# EAGLE design P2P_PROT_1 (EAGLE 6.5.0)

## Sheet 1 of 9
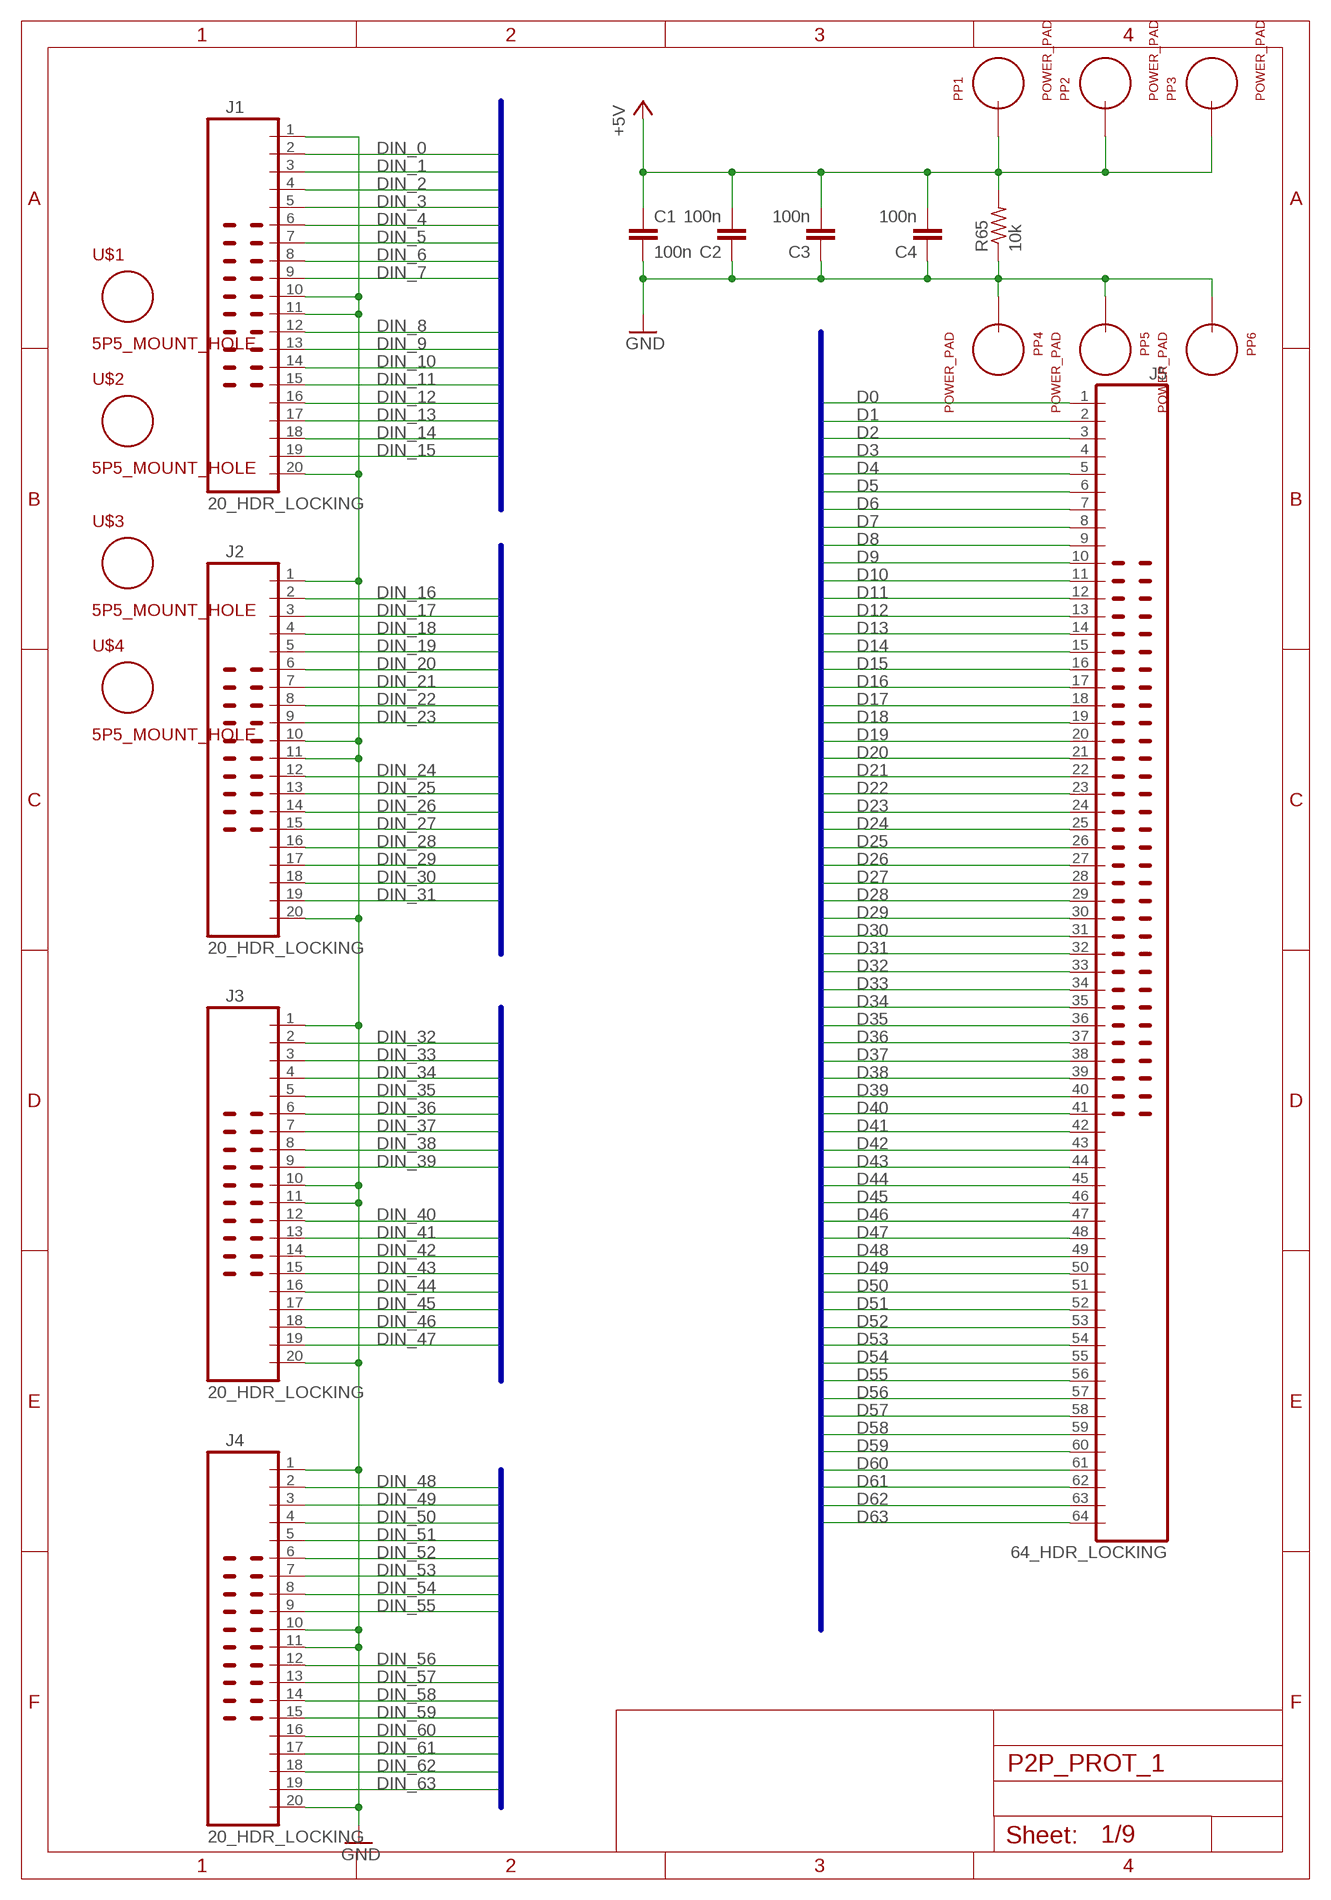
[diagram p0: schematic, sheet 1]

### Parts
C1  100n  C_P2INCH  [CAP_P2INCH]
C2  100n  C_P2INCH  [CAP_P2INCH]
C3  100n  C_P2INCH  [CAP_P2INCH]
C4  100n  C_P2INCH  [CAP_P2INCH]
J1  20_HDR_LOCKING  [20_HDR_LOCKING]
J2  20_HDR_LOCKING  [20_HDR_LOCKING]
J3  20_HDR_LOCKING  [20_HDR_LOCKING]
J4  20_HDR_LOCKING  [20_HDR_LOCKING]
J5  64_HDR_LOCKING  [64_HDR_LOCKING]
PP1  POWER_PAD  [POWER_PAD]
PP2  POWER_PAD  [POWER_PAD]
PP3  POWER_PAD  [POWER_PAD]
PP4  POWER_PAD  [POWER_PAD]
PP5  POWER_PAD  [POWER_PAD]
PP6  POWER_PAD  [POWER_PAD]
R65  10k  R_P2INCH  [R_P2INCH]
U$1  5P5_MOUNT_HOLE  [5P5M_HOLE]
U$2  5P5_MOUNT_HOLE  [5P5M_HOLE]
U$3  5P5_MOUNT_HOLE  [5P5M_HOLE]
U$4  5P5_MOUNT_HOLE  [5P5M_HOLE]

### Nets
+5V: C1.1 C2.2 C3.2 C4.2 PP1.1 PP2.1 PP3.1 R65.2 ; also sheet 2,3,4,5,6,7,8,9
D0: J5.1 ; also sheet 2
D1: J5.2 ; also sheet 2
D2: J5.3 ; also sheet 2
D3: J5.4 ; also sheet 2
D4: J5.5 ; also sheet 2
D5: J5.6 ; also sheet 2
D6: J5.7 ; also sheet 2
D7: J5.8 ; also sheet 2
D8: J5.9 ; also sheet 3
D9: J5.10 ; also sheet 3
D10: J5.11 ; also sheet 3
D11: J5.12 ; also sheet 3
D12: J5.13 ; also sheet 3
D13: J5.14 ; also sheet 3
D14: J5.15 ; also sheet 3
D15: J5.16 ; also sheet 3
D16: J5.17 ; also sheet 4
D17: J5.18 ; also sheet 4
D18: J5.19 ; also sheet 4
D19: J5.20 ; also sheet 4
D20: J5.21 ; also sheet 4
D21: J5.22 ; also sheet 4
D22: J5.23 ; also sheet 4
D23: J5.24 ; also sheet 4
D24: J5.25 ; also sheet 5
D25: J5.26 ; also sheet 5
D26: J5.27 ; also sheet 5
D27: J5.28 ; also sheet 5
D28: J5.29 ; also sheet 5
D29: J5.30 ; also sheet 5
D30: J5.31 ; also sheet 5
D31: J5.32 ; also sheet 5
D32: J5.33 ; also sheet 6
D33: J5.34 ; also sheet 6
D34: J5.35 ; also sheet 6
D35: J5.36 ; also sheet 6
D36: J5.37 ; also sheet 6
D37: J5.38 ; also sheet 6
D38: J5.39 ; also sheet 6
D39: J5.40 ; also sheet 6
D40: J5.41 ; also sheet 7
D41: J5.42 ; also sheet 7
D42: J5.43 ; also sheet 7
D43: J5.44 ; also sheet 7
D44: J5.45 ; also sheet 7
D45: J5.46 ; also sheet 7
D46: J5.47 ; also sheet 7
D47: J5.48 ; also sheet 7
D48: J5.49 ; also sheet 8
D49: J5.50 ; also sheet 8
D50: J5.51 ; also sheet 8
D51: J5.52 ; also sheet 8
D52: J5.53 ; also sheet 8
D53: J5.54 ; also sheet 8
D54: J5.55 ; also sheet 8
D55: J5.56 ; also sheet 8
D56: J5.57 ; also sheet 9
D57: J5.58 ; also sheet 9
D58: J5.59 ; also sheet 9
D59: J5.60 ; also sheet 9
D60: J5.61 ; also sheet 9
D61: J5.62 ; also sheet 9
D62: J5.63 ; also sheet 9
D63: J5.64 ; also sheet 9
DIN_0: J1.2 ; also sheet 2
DIN_1: J1.3 ; also sheet 2
DIN_2: J1.4 ; also sheet 2
DIN_3: J1.5 ; also sheet 2
DIN_4: J1.6 ; also sheet 2
DIN_5: J1.7 ; also sheet 2
DIN_6: J1.8 ; also sheet 2
DIN_7: J1.9 ; also sheet 2
DIN_8: J1.12 ; also sheet 3
DIN_9: J1.13 ; also sheet 3
DIN_10: J1.14 ; also sheet 3
DIN_11: J1.15 ; also sheet 3
DIN_12: J1.16 ; also sheet 3
DIN_13: J1.17 ; also sheet 3
DIN_14: J1.18 ; also sheet 3
DIN_15: J1.19 ; also sheet 3
DIN_16: J2.2 ; also sheet 4
DIN_17: J2.3 ; also sheet 4
DIN_18: J2.4 ; also sheet 4
DIN_19: J2.5 ; also sheet 4
DIN_20: J2.6 ; also sheet 4
DIN_21: J2.7 ; also sheet 4
DIN_22: J2.8 ; also sheet 4
DIN_23: J2.9 ; also sheet 4
DIN_24: J2.12 ; also sheet 5
DIN_25: J2.13 ; also sheet 5
DIN_26: J2.14 ; also sheet 5
DIN_27: J2.15 ; also sheet 5
DIN_28: J2.16 ; also sheet 5
DIN_29: J2.17 ; also sheet 5
DIN_30: J2.18 ; also sheet 5
DIN_31: J2.19 ; also sheet 5
DIN_32: J3.2 ; also sheet 6
DIN_33: J3.3 ; also sheet 6
DIN_34: J3.4 ; also sheet 6
DIN_35: J3.5 ; also sheet 6
DIN_36: J3.6 ; also sheet 6
DIN_37: J3.7 ; also sheet 6
DIN_38: J3.8 ; also sheet 6
DIN_39: J3.9 ; also sheet 6
DIN_40: J3.12 ; also sheet 7
DIN_41: J3.13 ; also sheet 7
DIN_42: J3.14 ; also sheet 7
DIN_43: J3.15 ; also sheet 7
DIN_44: J3.16 ; also sheet 7
DIN_45: J3.17 ; also sheet 7
DIN_46: J3.18 ; also sheet 7
DIN_47: J3.19 ; also sheet 7
DIN_48: J4.2 ; also sheet 8
DIN_49: J4.3 ; also sheet 8
DIN_50: J4.4 ; also sheet 8
DIN_51: J4.5 ; also sheet 8
DIN_52: J4.6 ; also sheet 8
DIN_53: J4.7 ; also sheet 8
DIN_54: J4.8 ; also sheet 8
DIN_55: J4.9 ; also sheet 8
DIN_56: J4.12 ; also sheet 9
DIN_57: J4.13 ; also sheet 9
DIN_58: J4.14 ; also sheet 9
DIN_59: J4.15 ; also sheet 9
DIN_60: J4.16 ; also sheet 9
DIN_61: J4.17 ; also sheet 9
DIN_62: J4.18 ; also sheet 9
DIN_63: J4.19 ; also sheet 9
GND: C1.2 C2.1 C3.1 C4.1 J1.1 J1.10 J1.11 J1.20 J2.1 J2.10 J2.11 J2.20 J3.1 J3.10 J3.11 J3.20 J4.1 J4.10 J4.11 J4.20 PP4.1 PP5.1 PP6.1 R65.1 ; also sheet 2,3,4,5,6,7,8,9

### Buses
D[0..63]
DIN_[0..15]
DIN_[16..31]
DIN_[32..47]
DIN_[48..63]

## Sheet 2 of 9
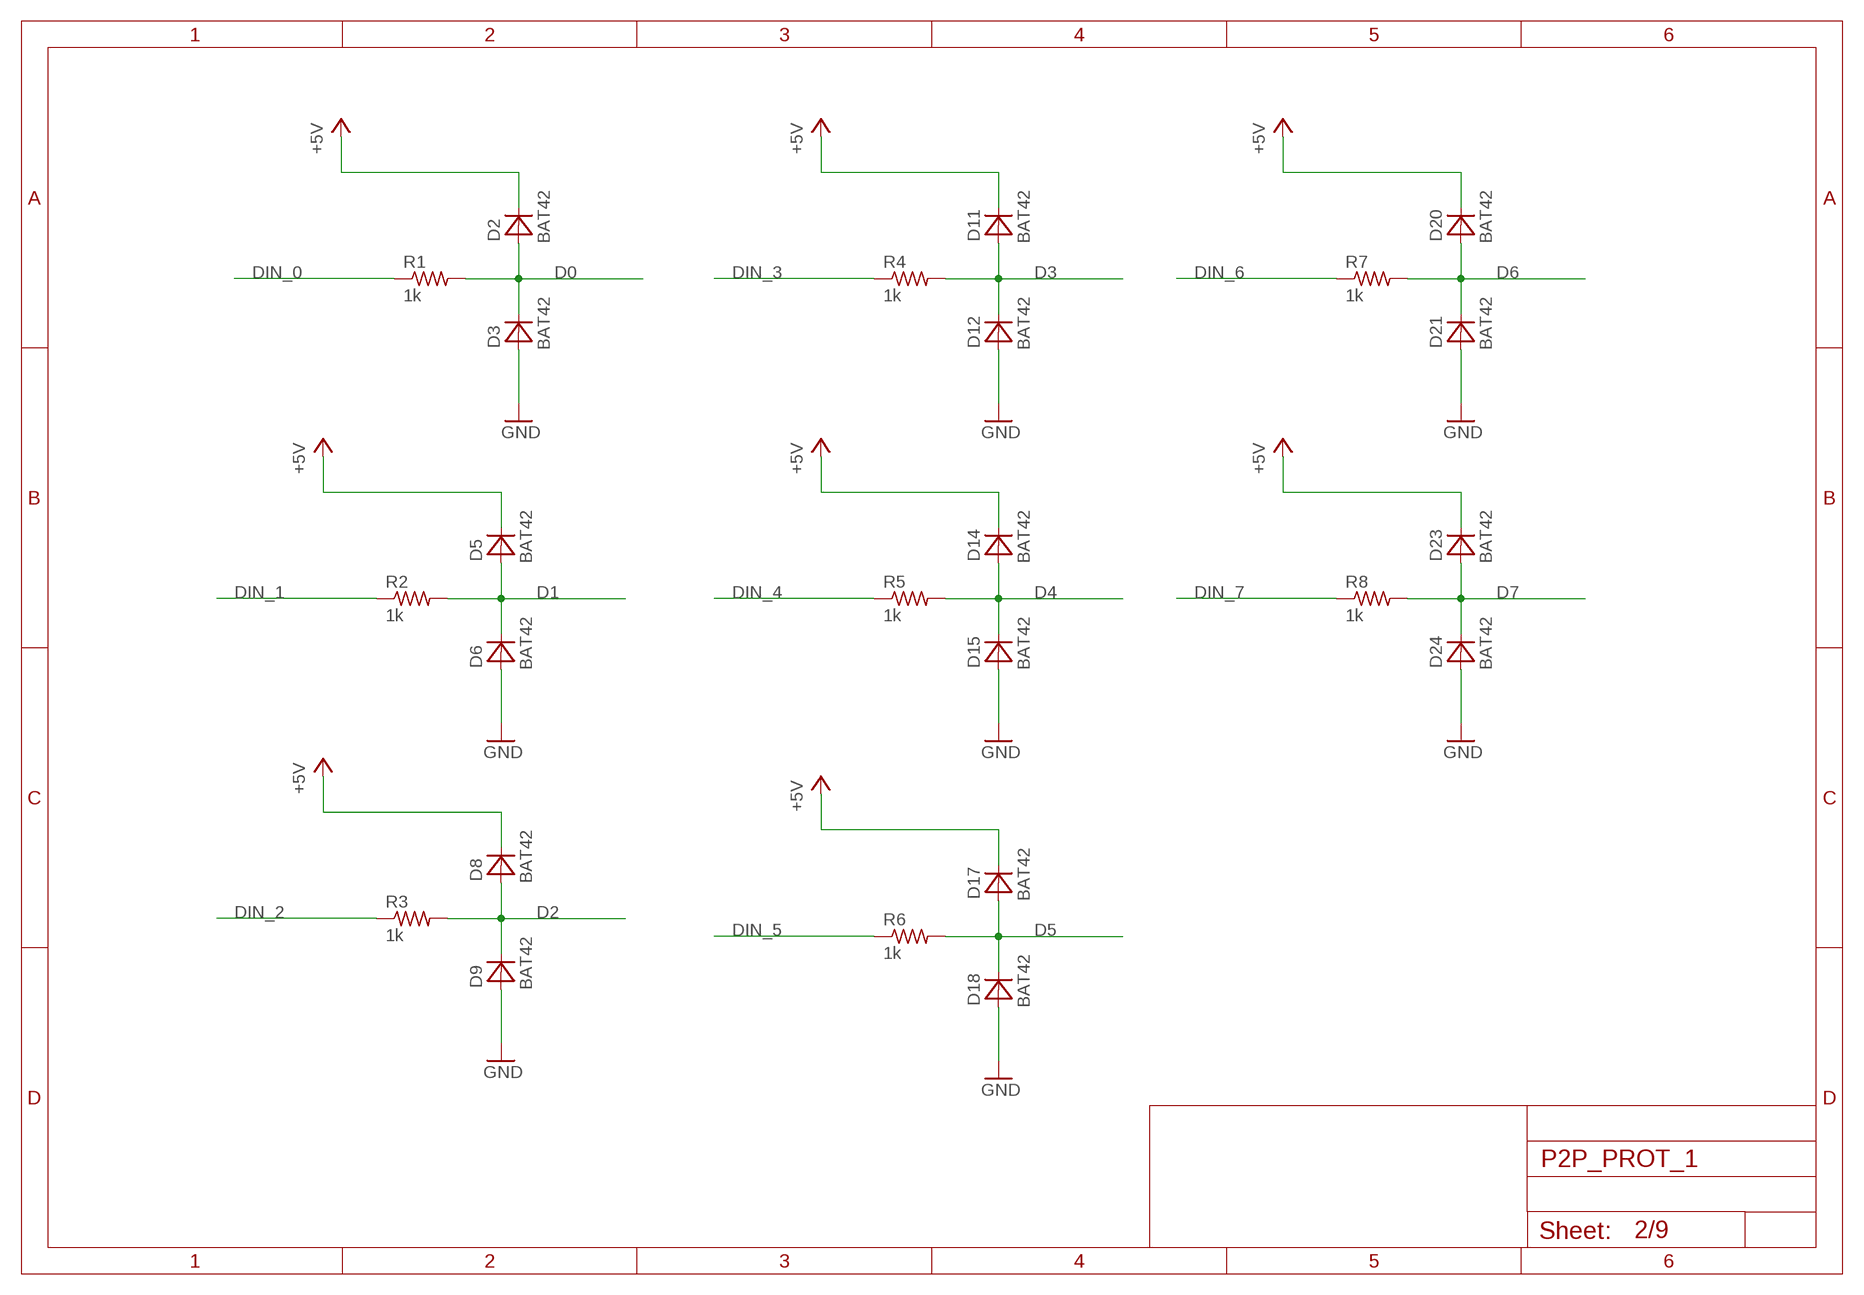
[diagram p1: schematic, sheet 2]

### Parts
D2  BAT42  [DO34-5]
D3  BAT42  [DO34-5]
D5  BAT42  [DO34-5]
D6  BAT42  [DO34-5]
D8  BAT42  [DO34-5]
D9  BAT42  [DO34-5]
D11  BAT42  [DO34-5]
D12  BAT42  [DO34-5]
D14  BAT42  [DO34-5]
D15  BAT42  [DO34-5]
D17  BAT42  [DO34-5]
D18  BAT42  [DO34-5]
D20  BAT42  [DO34-5]
D21  BAT42  [DO34-5]
D23  BAT42  [DO34-5]
D24  BAT42  [DO34-5]
R1  1k  R_P2INCH  [R_P2INCH]
R2  1k  R_P2INCH  [R_P2INCH]
R3  1k  R_P2INCH  [R_P2INCH]
R4  1k  R_P2INCH  [R_P2INCH]
R5  1k  R_P2INCH  [R_P2INCH]
R6  1k  R_P2INCH  [R_P2INCH]
R7  1k  R_P2INCH  [R_P2INCH]
R8  1k  R_P2INCH  [R_P2INCH]

### Nets
+5V: D2.C D5.C D8.C D11.C D14.C D17.C D20.C D23.C ; also sheet 1,3,4,5,6,7,8,9
D0: D2.A D3.C R1.2 ; also sheet 1
D1: D5.A D6.C R2.2 ; also sheet 1
D2: D8.A D9.C R3.2 ; also sheet 1
D3: D11.A D12.C R4.2 ; also sheet 1
D4: D14.A D15.C R5.2 ; also sheet 1
D5: D17.A D18.C R6.2 ; also sheet 1
D6: D20.A D21.C R7.2 ; also sheet 1
D7: D23.A D24.C R8.2 ; also sheet 1
DIN_0: R1.1 ; also sheet 1
DIN_1: R2.1 ; also sheet 1
DIN_2: R3.1 ; also sheet 1
DIN_3: R4.1 ; also sheet 1
DIN_4: R5.1 ; also sheet 1
DIN_5: R6.1 ; also sheet 1
DIN_6: R7.1 ; also sheet 1
DIN_7: R8.1 ; also sheet 1
GND: D3.A D6.A D9.A D12.A D15.A D18.A D21.A D24.A ; also sheet 1,3,4,5,6,7,8,9

## Sheet 3 of 9
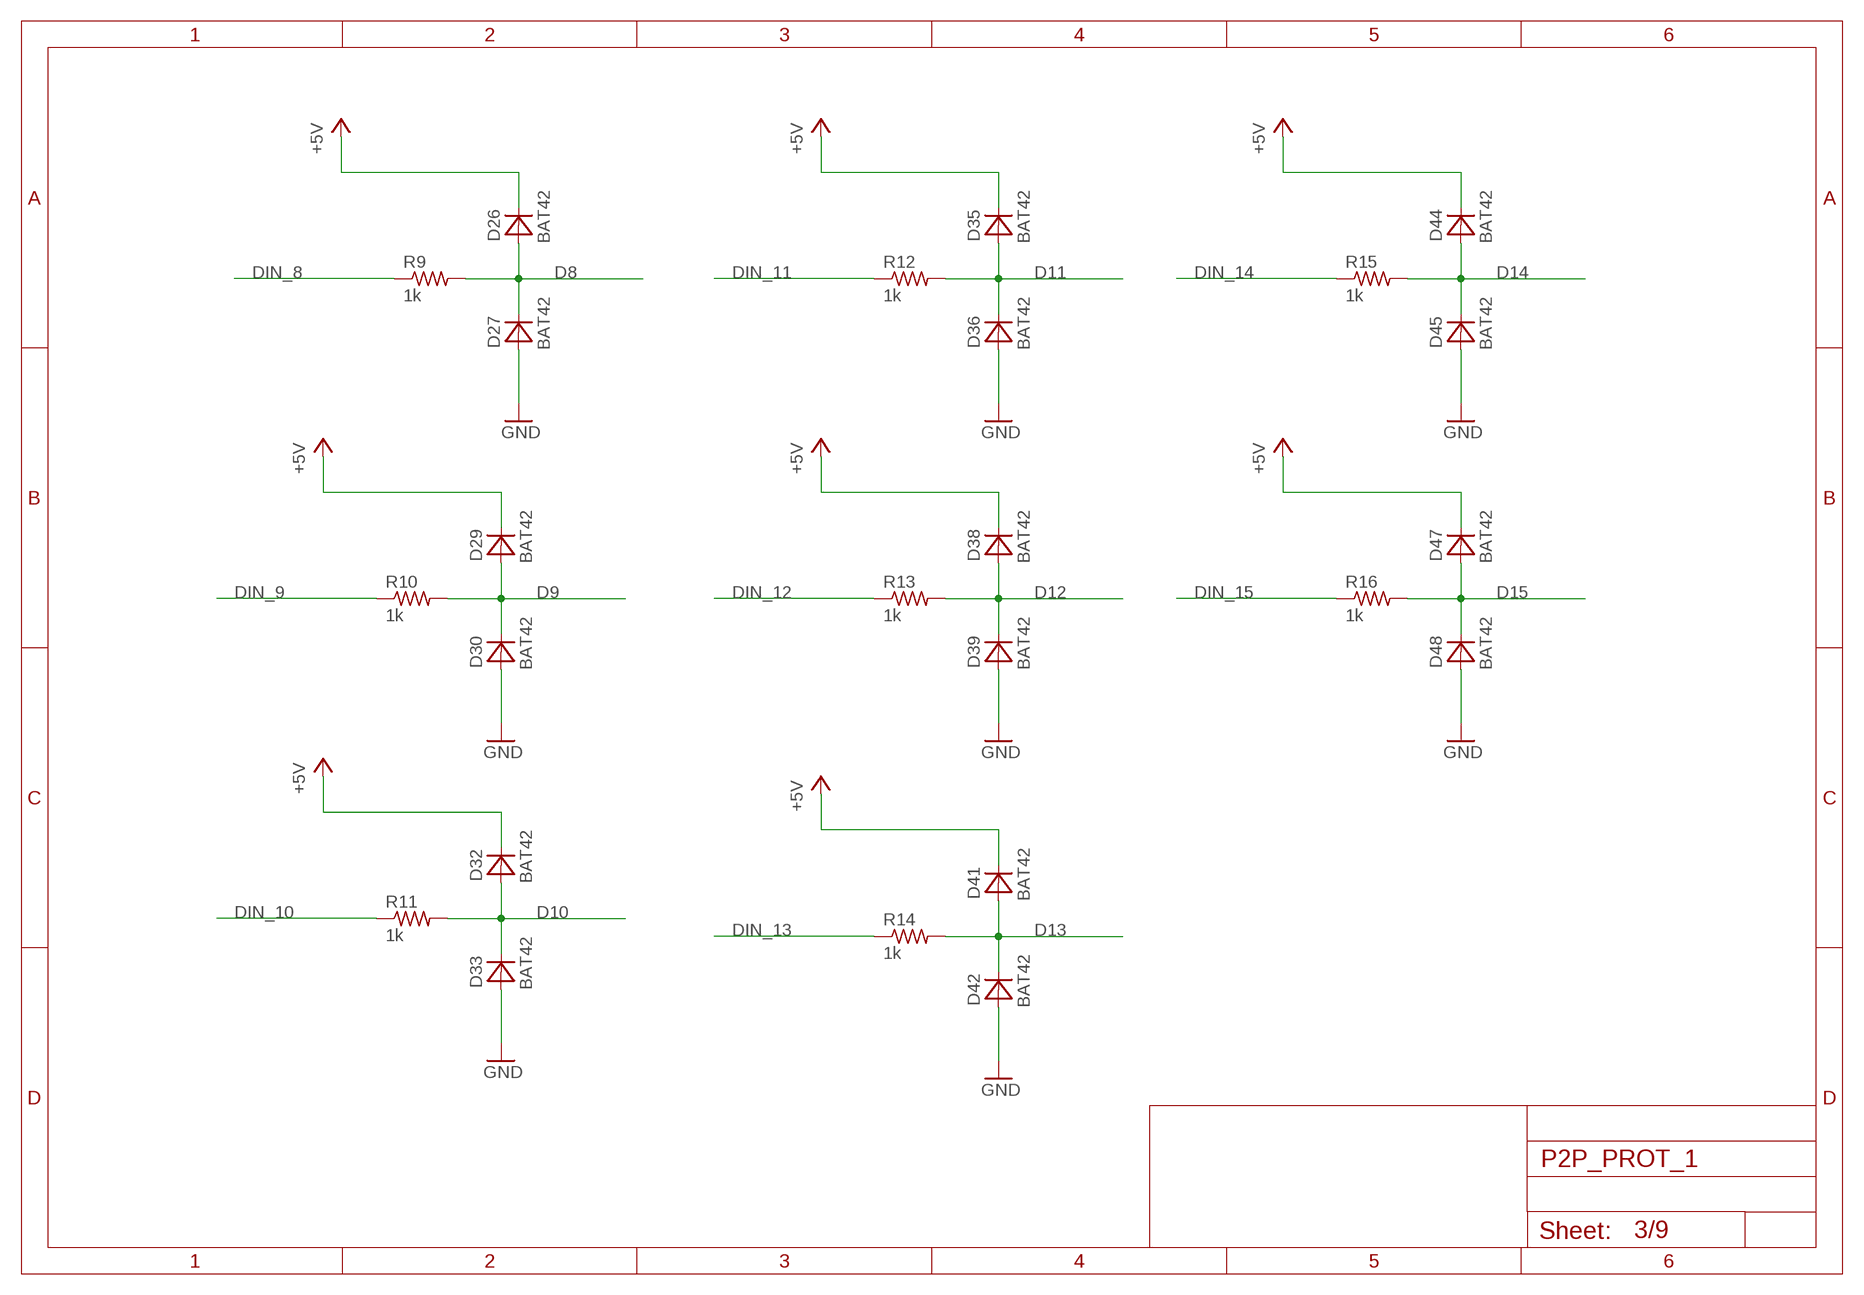
[diagram p2: schematic, sheet 3]

### Parts
D26  BAT42  [DO34-5]
D27  BAT42  [DO34-5]
D29  BAT42  [DO34-5]
D30  BAT42  [DO34-5]
D32  BAT42  [DO34-5]
D33  BAT42  [DO34-5]
D35  BAT42  [DO34-5]
D36  BAT42  [DO34-5]
D38  BAT42  [DO34-5]
D39  BAT42  [DO34-5]
D41  BAT42  [DO34-5]
D42  BAT42  [DO34-5]
D44  BAT42  [DO34-5]
D45  BAT42  [DO34-5]
D47  BAT42  [DO34-5]
D48  BAT42  [DO34-5]
R9  1k  R_P2INCH  [R_P2INCH]
R10  1k  R_P2INCH  [R_P2INCH]
R11  1k  R_P2INCH  [R_P2INCH]
R12  1k  R_P2INCH  [R_P2INCH]
R13  1k  R_P2INCH  [R_P2INCH]
R14  1k  R_P2INCH  [R_P2INCH]
R15  1k  R_P2INCH  [R_P2INCH]
R16  1k  R_P2INCH  [R_P2INCH]

### Nets
+5V: D26.C D29.C D32.C D35.C D38.C D41.C D44.C D47.C ; also sheet 1,2,4,5,6,7,8,9
D8: D26.A D27.C R9.2 ; also sheet 1
D9: D29.A D30.C R10.2 ; also sheet 1
D10: D32.A D33.C R11.2 ; also sheet 1
D11: D35.A D36.C R12.2 ; also sheet 1
D12: D38.A D39.C R13.2 ; also sheet 1
D13: D41.A D42.C R14.2 ; also sheet 1
D14: D44.A D45.C R15.2 ; also sheet 1
D15: D47.A D48.C R16.2 ; also sheet 1
DIN_8: R9.1 ; also sheet 1
DIN_9: R10.1 ; also sheet 1
DIN_10: R11.1 ; also sheet 1
DIN_11: R12.1 ; also sheet 1
DIN_12: R13.1 ; also sheet 1
DIN_13: R14.1 ; also sheet 1
DIN_14: R15.1 ; also sheet 1
DIN_15: R16.1 ; also sheet 1
GND: D27.A D30.A D33.A D36.A D39.A D42.A D45.A D48.A ; also sheet 1,2,4,5,6,7,8,9

## Sheet 4 of 9
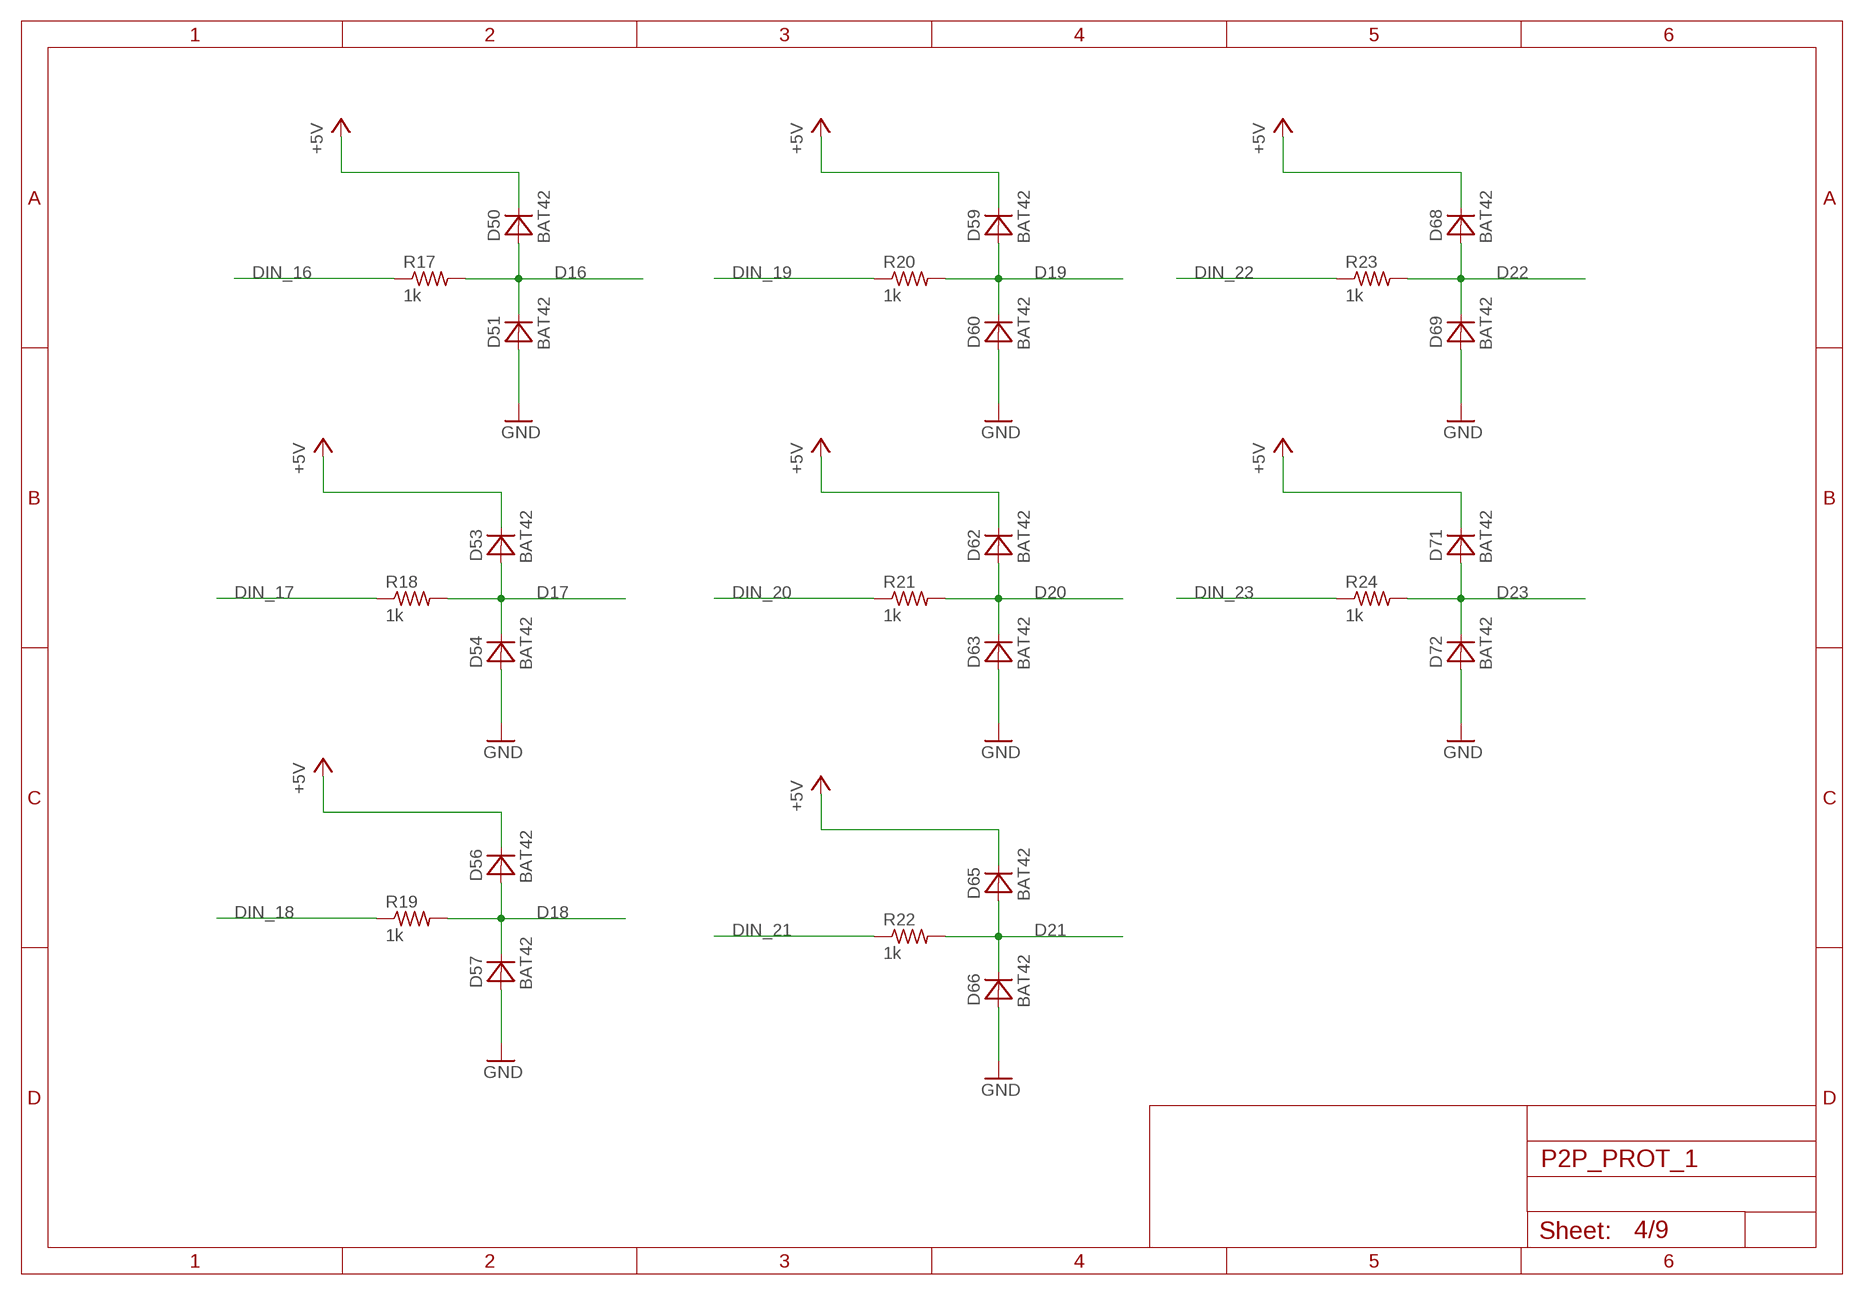
[diagram p3: schematic, sheet 4]

### Parts
D50  BAT42  [DO34-5]
D51  BAT42  [DO34-5]
D53  BAT42  [DO34-5]
D54  BAT42  [DO34-5]
D56  BAT42  [DO34-5]
D57  BAT42  [DO34-5]
D59  BAT42  [DO34-5]
D60  BAT42  [DO34-5]
D62  BAT42  [DO34-5]
D63  BAT42  [DO34-5]
D65  BAT42  [DO34-5]
D66  BAT42  [DO34-5]
D68  BAT42  [DO34-5]
D69  BAT42  [DO34-5]
D71  BAT42  [DO34-5]
D72  BAT42  [DO34-5]
R17  1k  R_P2INCH  [R_P2INCH]
R18  1k  R_P2INCH  [R_P2INCH]
R19  1k  R_P2INCH  [R_P2INCH]
R20  1k  R_P2INCH  [R_P2INCH]
R21  1k  R_P2INCH  [R_P2INCH]
R22  1k  R_P2INCH  [R_P2INCH]
R23  1k  R_P2INCH  [R_P2INCH]
R24  1k  R_P2INCH  [R_P2INCH]

### Nets
+5V: D50.C D53.C D56.C D59.C D62.C D65.C D68.C D71.C ; also sheet 1,2,3,5,6,7,8,9
D16: D50.A D51.C R17.2 ; also sheet 1
D17: D53.A D54.C R18.2 ; also sheet 1
D18: D56.A D57.C R19.2 ; also sheet 1
D19: D59.A D60.C R20.2 ; also sheet 1
D20: D62.A D63.C R21.2 ; also sheet 1
D21: D65.A D66.C R22.2 ; also sheet 1
D22: D68.A D69.C R23.2 ; also sheet 1
D23: D71.A D72.C R24.2 ; also sheet 1
DIN_16: R17.1 ; also sheet 1
DIN_17: R18.1 ; also sheet 1
DIN_18: R19.1 ; also sheet 1
DIN_19: R20.1 ; also sheet 1
DIN_20: R21.1 ; also sheet 1
DIN_21: R22.1 ; also sheet 1
DIN_22: R23.1 ; also sheet 1
DIN_23: R24.1 ; also sheet 1
GND: D51.A D54.A D57.A D60.A D63.A D66.A D69.A D72.A ; also sheet 1,2,3,5,6,7,8,9

## Sheet 5 of 9
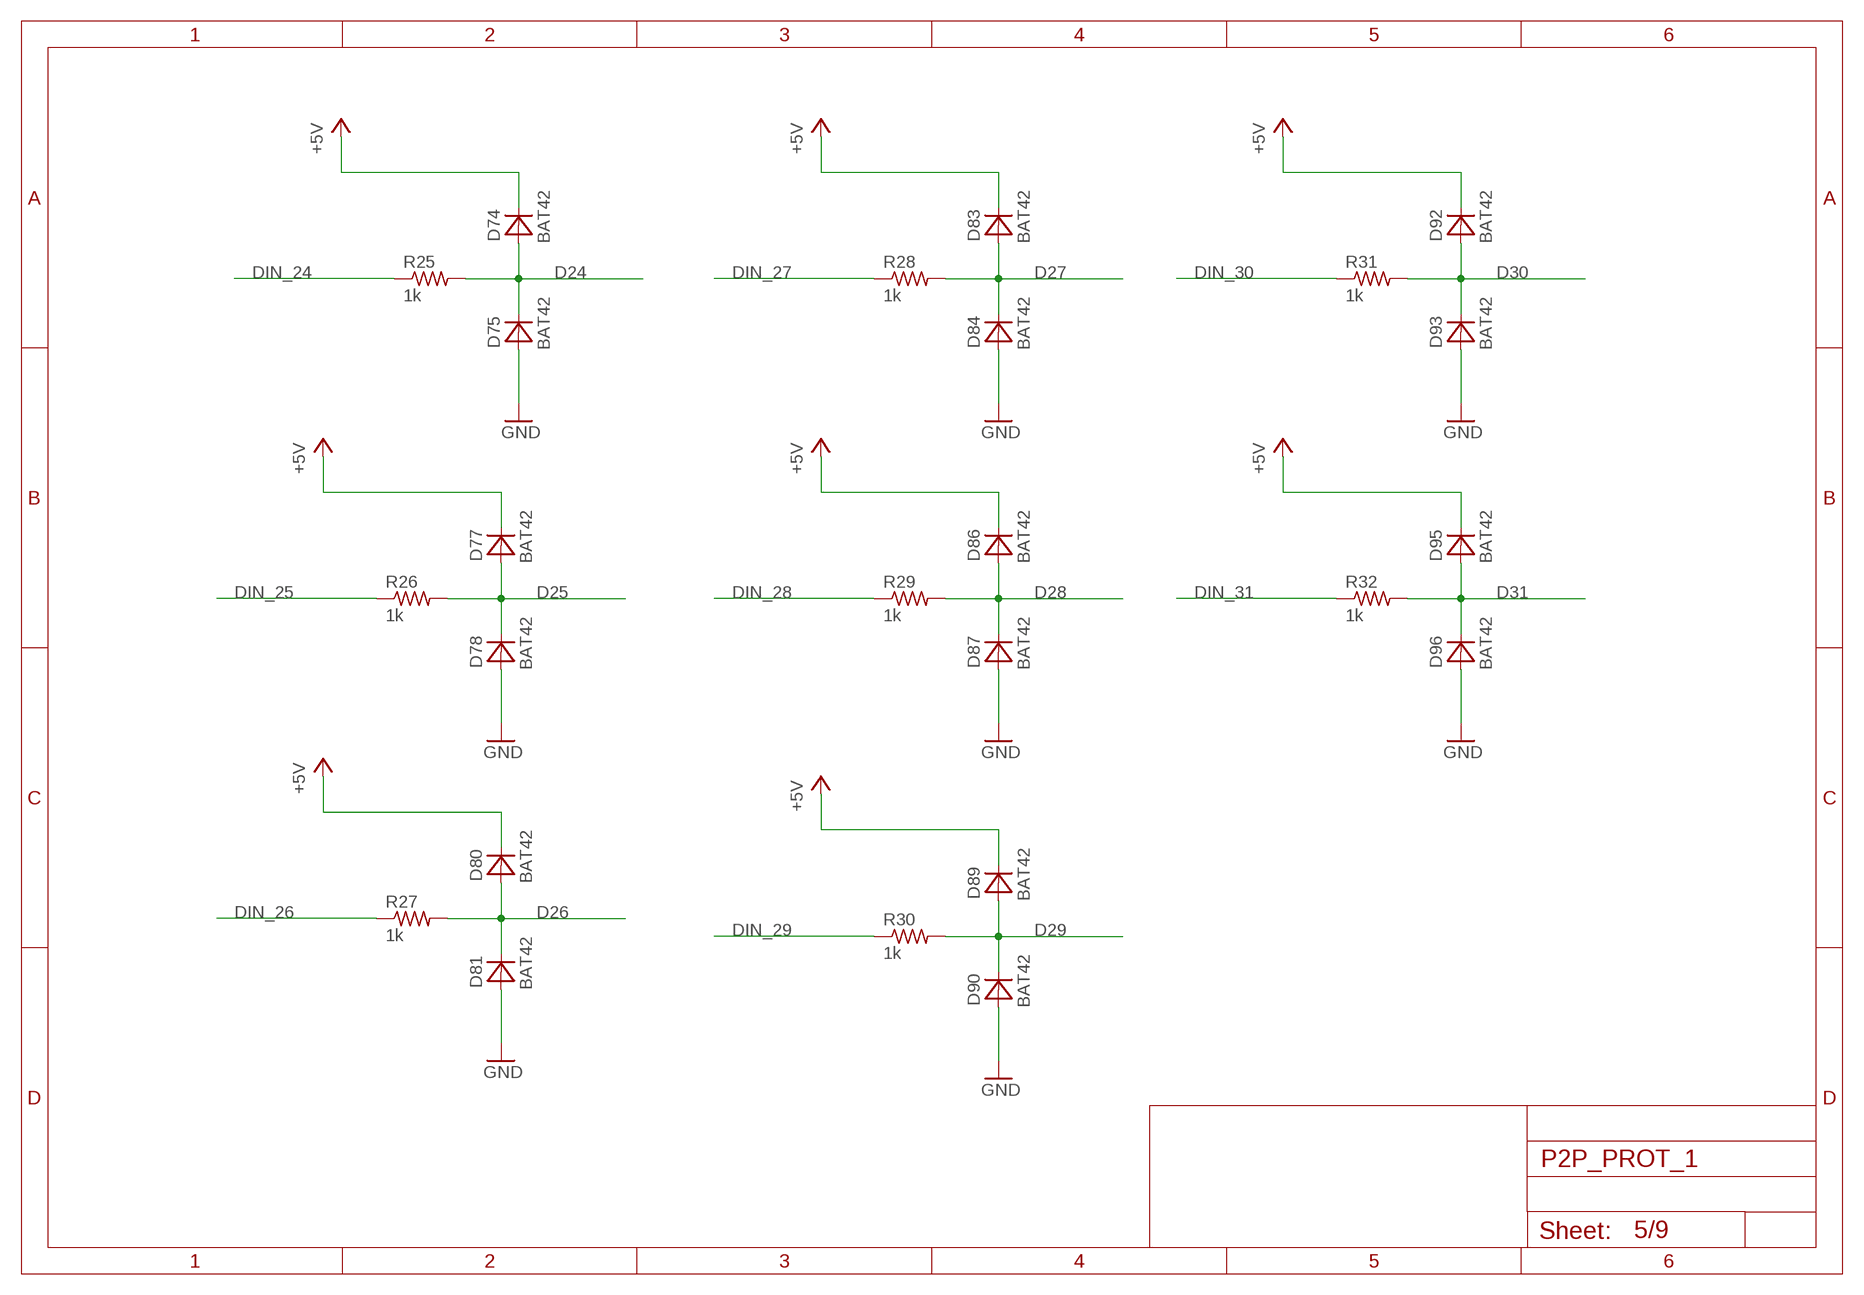
[diagram p4: schematic, sheet 5]

### Parts
D74  BAT42  [DO34-5]
D75  BAT42  [DO34-5]
D77  BAT42  [DO34-5]
D78  BAT42  [DO34-5]
D80  BAT42  [DO34-5]
D81  BAT42  [DO34-5]
D83  BAT42  [DO34-5]
D84  BAT42  [DO34-5]
D86  BAT42  [DO34-5]
D87  BAT42  [DO34-5]
D89  BAT42  [DO34-5]
D90  BAT42  [DO34-5]
D92  BAT42  [DO34-5]
D93  BAT42  [DO34-5]
D95  BAT42  [DO34-5]
D96  BAT42  [DO34-5]
R25  1k  R_P2INCH  [R_P2INCH]
R26  1k  R_P2INCH  [R_P2INCH]
R27  1k  R_P2INCH  [R_P2INCH]
R28  1k  R_P2INCH  [R_P2INCH]
R29  1k  R_P2INCH  [R_P2INCH]
R30  1k  R_P2INCH  [R_P2INCH]
R31  1k  R_P2INCH  [R_P2INCH]
R32  1k  R_P2INCH  [R_P2INCH]

### Nets
+5V: D74.C D77.C D80.C D83.C D86.C D89.C D92.C D95.C ; also sheet 1,2,3,4,6,7,8,9
D24: D74.A D75.C R25.2 ; also sheet 1
D25: D77.A D78.C R26.2 ; also sheet 1
D26: D80.A D81.C R27.2 ; also sheet 1
D27: D83.A D84.C R28.2 ; also sheet 1
D28: D86.A D87.C R29.2 ; also sheet 1
D29: D89.A D90.C R30.2 ; also sheet 1
D30: D92.A D93.C R31.2 ; also sheet 1
D31: D95.A D96.C R32.2 ; also sheet 1
DIN_24: R25.1 ; also sheet 1
DIN_25: R26.1 ; also sheet 1
DIN_26: R27.1 ; also sheet 1
DIN_27: R28.1 ; also sheet 1
DIN_28: R29.1 ; also sheet 1
DIN_29: R30.1 ; also sheet 1
DIN_30: R31.1 ; also sheet 1
DIN_31: R32.1 ; also sheet 1
GND: D75.A D78.A D81.A D84.A D87.A D90.A D93.A D96.A ; also sheet 1,2,3,4,6,7,8,9

## Sheet 6 of 9
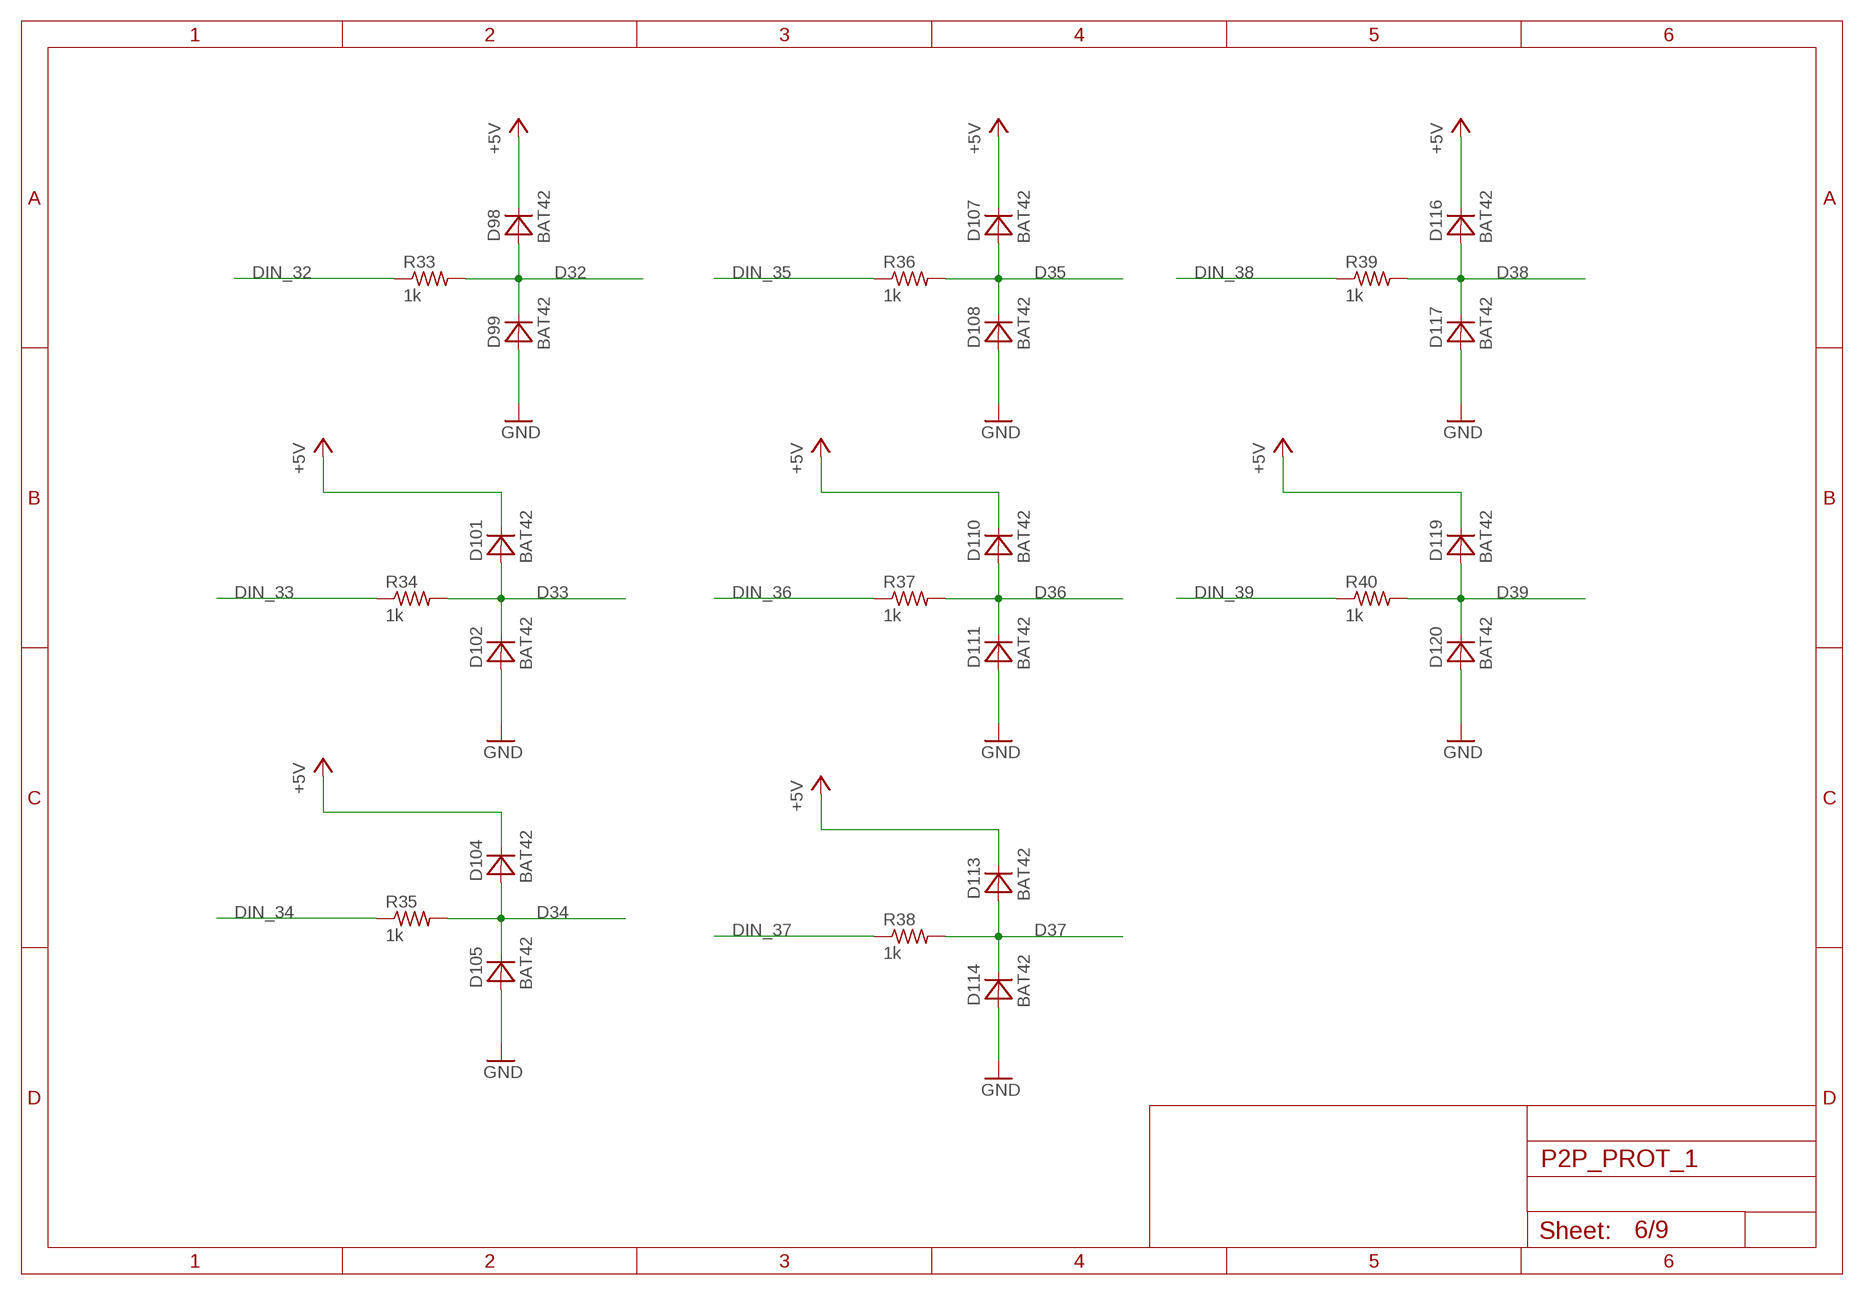
[diagram p5: schematic, sheet 6]

### Parts
D98  BAT42  [DO34-5]
D99  BAT42  [DO34-5]
D101  BAT42  [DO34-5]
D102  BAT42  [DO34-5]
D104  BAT42  [DO34-5]
D105  BAT42  [DO34-5]
D107  BAT42  [DO34-5]
D108  BAT42  [DO34-5]
D110  BAT42  [DO34-5]
D111  BAT42  [DO34-5]
D113  BAT42  [DO34-5]
D114  BAT42  [DO34-5]
D116  BAT42  [DO34-5]
D117  BAT42  [DO34-5]
D119  BAT42  [DO34-5]
D120  BAT42  [DO34-5]
R33  1k  R_P2INCH  [R_P2INCH]
R34  1k  R_P2INCH  [R_P2INCH]
R35  1k  R_P2INCH  [R_P2INCH]
R36  1k  R_P2INCH  [R_P2INCH]
R37  1k  R_P2INCH  [R_P2INCH]
R38  1k  R_P2INCH  [R_P2INCH]
R39  1k  R_P2INCH  [R_P2INCH]
R40  1k  R_P2INCH  [R_P2INCH]

### Nets
+5V: D98.C D101.C D104.C D107.C D110.C D113.C D116.C D119.C ; also sheet 1,2,3,4,5,7,8,9
D32: D98.A D99.C R33.2 ; also sheet 1
D33: D101.A D102.C R34.2 ; also sheet 1
D34: D104.A D105.C R35.2 ; also sheet 1
D35: D107.A D108.C R36.2 ; also sheet 1
D36: D110.A D111.C R37.2 ; also sheet 1
D37: D113.A D114.C R38.2 ; also sheet 1
D38: D116.A D117.C R39.2 ; also sheet 1
D39: D119.A D120.C R40.2 ; also sheet 1
DIN_32: R33.1 ; also sheet 1
DIN_33: R34.1 ; also sheet 1
DIN_34: R35.1 ; also sheet 1
DIN_35: R36.1 ; also sheet 1
DIN_36: R37.1 ; also sheet 1
DIN_37: R38.1 ; also sheet 1
DIN_38: R39.1 ; also sheet 1
DIN_39: R40.1 ; also sheet 1
GND: D99.A D102.A D105.A D108.A D111.A D114.A D117.A D120.A ; also sheet 1,2,3,4,5,7,8,9

## Sheet 7 of 9
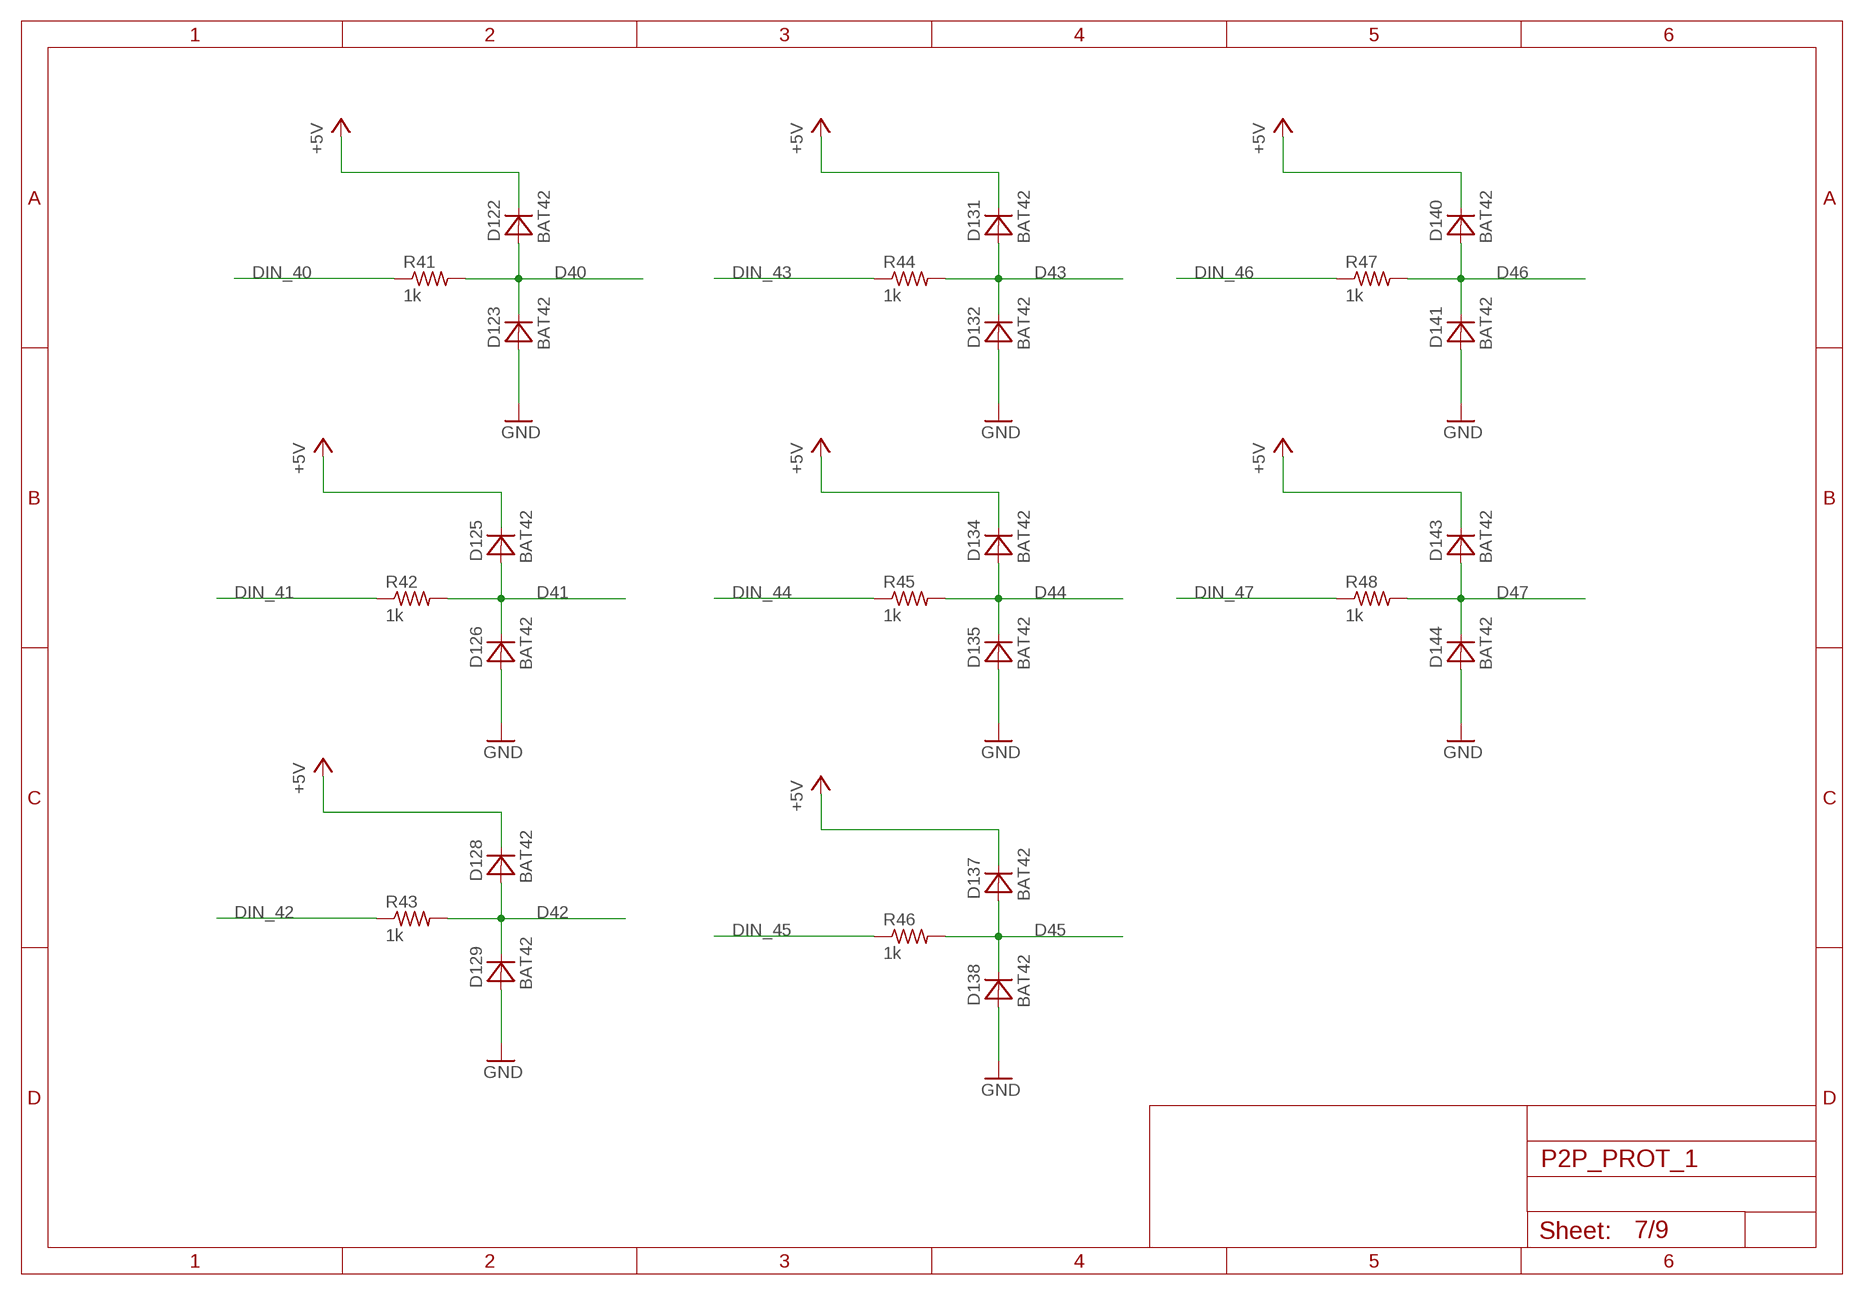
[diagram p6: schematic, sheet 7]

### Parts
D122  BAT42  [DO34-5]
D123  BAT42  [DO34-5]
D125  BAT42  [DO34-5]
D126  BAT42  [DO34-5]
D128  BAT42  [DO34-5]
D129  BAT42  [DO34-5]
D131  BAT42  [DO34-5]
D132  BAT42  [DO34-5]
D134  BAT42  [DO34-5]
D135  BAT42  [DO34-5]
D137  BAT42  [DO34-5]
D138  BAT42  [DO34-5]
D140  BAT42  [DO34-5]
D141  BAT42  [DO34-5]
D143  BAT42  [DO34-5]
D144  BAT42  [DO34-5]
R41  1k  R_P2INCH  [R_P2INCH]
R42  1k  R_P2INCH  [R_P2INCH]
R43  1k  R_P2INCH  [R_P2INCH]
R44  1k  R_P2INCH  [R_P2INCH]
R45  1k  R_P2INCH  [R_P2INCH]
R46  1k  R_P2INCH  [R_P2INCH]
R47  1k  R_P2INCH  [R_P2INCH]
R48  1k  R_P2INCH  [R_P2INCH]

### Nets
+5V: D122.C D125.C D128.C D131.C D134.C D137.C D140.C D143.C ; also sheet 1,2,3,4,5,6,8,9
D40: D122.A D123.C R41.2 ; also sheet 1
D41: D125.A D126.C R42.2 ; also sheet 1
D42: D128.A D129.C R43.2 ; also sheet 1
D43: D131.A D132.C R44.2 ; also sheet 1
D44: D134.A D135.C R45.2 ; also sheet 1
D45: D137.A D138.C R46.2 ; also sheet 1
D46: D140.A D141.C R47.2 ; also sheet 1
D47: D143.A D144.C R48.2 ; also sheet 1
DIN_40: R41.1 ; also sheet 1
DIN_41: R42.1 ; also sheet 1
DIN_42: R43.1 ; also sheet 1
DIN_43: R44.1 ; also sheet 1
DIN_44: R45.1 ; also sheet 1
DIN_45: R46.1 ; also sheet 1
DIN_46: R47.1 ; also sheet 1
DIN_47: R48.1 ; also sheet 1
GND: D123.A D126.A D129.A D132.A D135.A D138.A D141.A D144.A ; also sheet 1,2,3,4,5,6,8,9

## Sheet 8 of 9
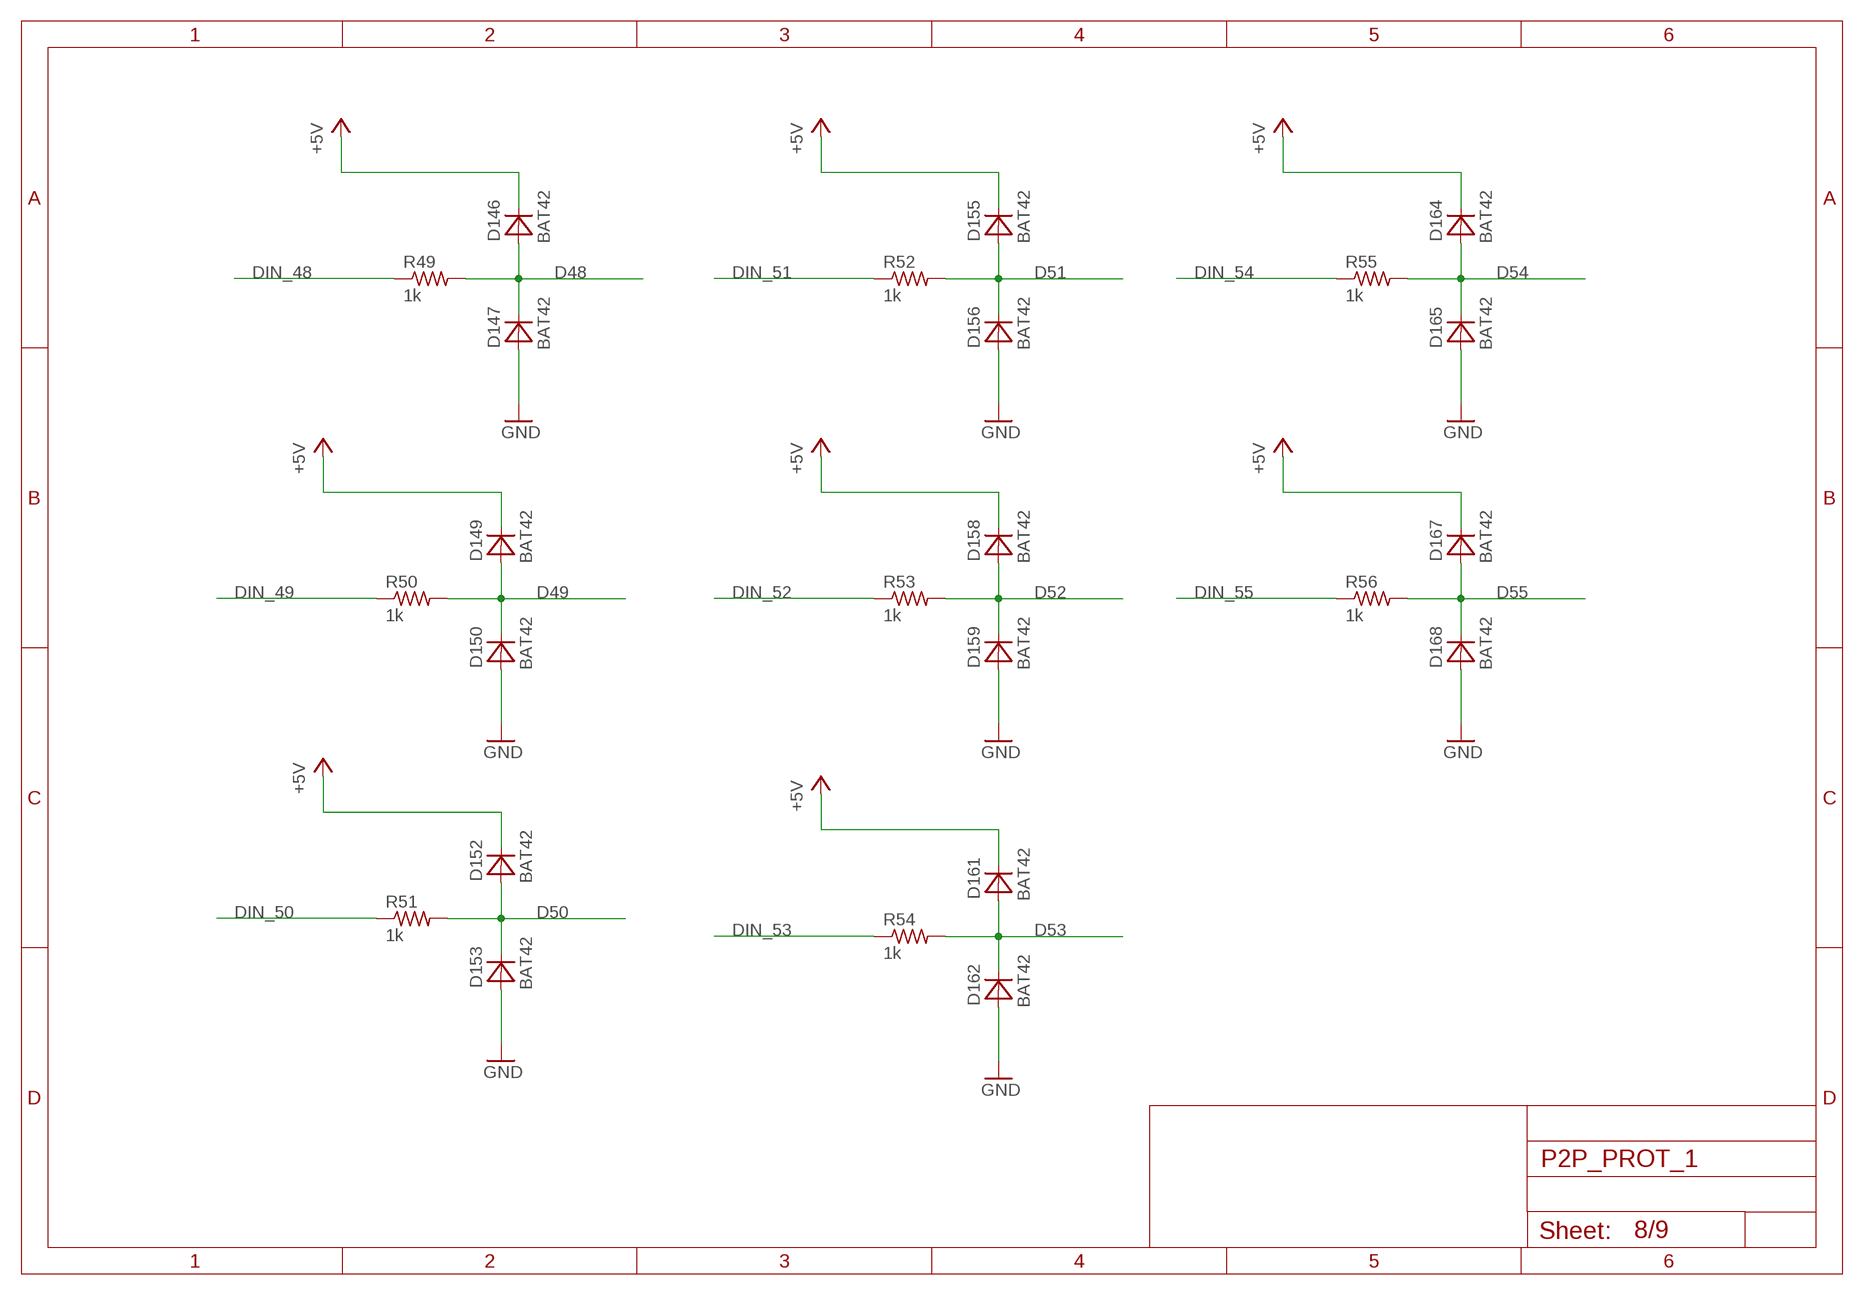
[diagram p7: schematic, sheet 8]

### Parts
D146  BAT42  [DO34-5]
D147  BAT42  [DO34-5]
D149  BAT42  [DO34-5]
D150  BAT42  [DO34-5]
D152  BAT42  [DO34-5]
D153  BAT42  [DO34-5]
D155  BAT42  [DO34-5]
D156  BAT42  [DO34-5]
D158  BAT42  [DO34-5]
D159  BAT42  [DO34-5]
D161  BAT42  [DO34-5]
D162  BAT42  [DO34-5]
D164  BAT42  [DO34-5]
D165  BAT42  [DO34-5]
D167  BAT42  [DO34-5]
D168  BAT42  [DO34-5]
R49  1k  R_P2INCH  [R_P2INCH]
R50  1k  R_P2INCH  [R_P2INCH]
R51  1k  R_P2INCH  [R_P2INCH]
R52  1k  R_P2INCH  [R_P2INCH]
R53  1k  R_P2INCH  [R_P2INCH]
R54  1k  R_P2INCH  [R_P2INCH]
R55  1k  R_P2INCH  [R_P2INCH]
R56  1k  R_P2INCH  [R_P2INCH]

### Nets
+5V: D146.C D149.C D152.C D155.C D158.C D161.C D164.C D167.C ; also sheet 1,2,3,4,5,6,7,9
D48: D146.A D147.C R49.2 ; also sheet 1
D49: D149.A D150.C R50.2 ; also sheet 1
D50: D152.A D153.C R51.2 ; also sheet 1
D51: D155.A D156.C R52.2 ; also sheet 1
D52: D158.A D159.C R53.2 ; also sheet 1
D53: D161.A D162.C R54.2 ; also sheet 1
D54: D164.A D165.C R55.2 ; also sheet 1
D55: D167.A D168.C R56.2 ; also sheet 1
DIN_48: R49.1 ; also sheet 1
DIN_49: R50.1 ; also sheet 1
DIN_50: R51.1 ; also sheet 1
DIN_51: R52.1 ; also sheet 1
DIN_52: R53.1 ; also sheet 1
DIN_53: R54.1 ; also sheet 1
DIN_54: R55.1 ; also sheet 1
DIN_55: R56.1 ; also sheet 1
GND: D147.A D150.A D153.A D156.A D159.A D162.A D165.A D168.A ; also sheet 1,2,3,4,5,6,7,9

## Sheet 9 of 9
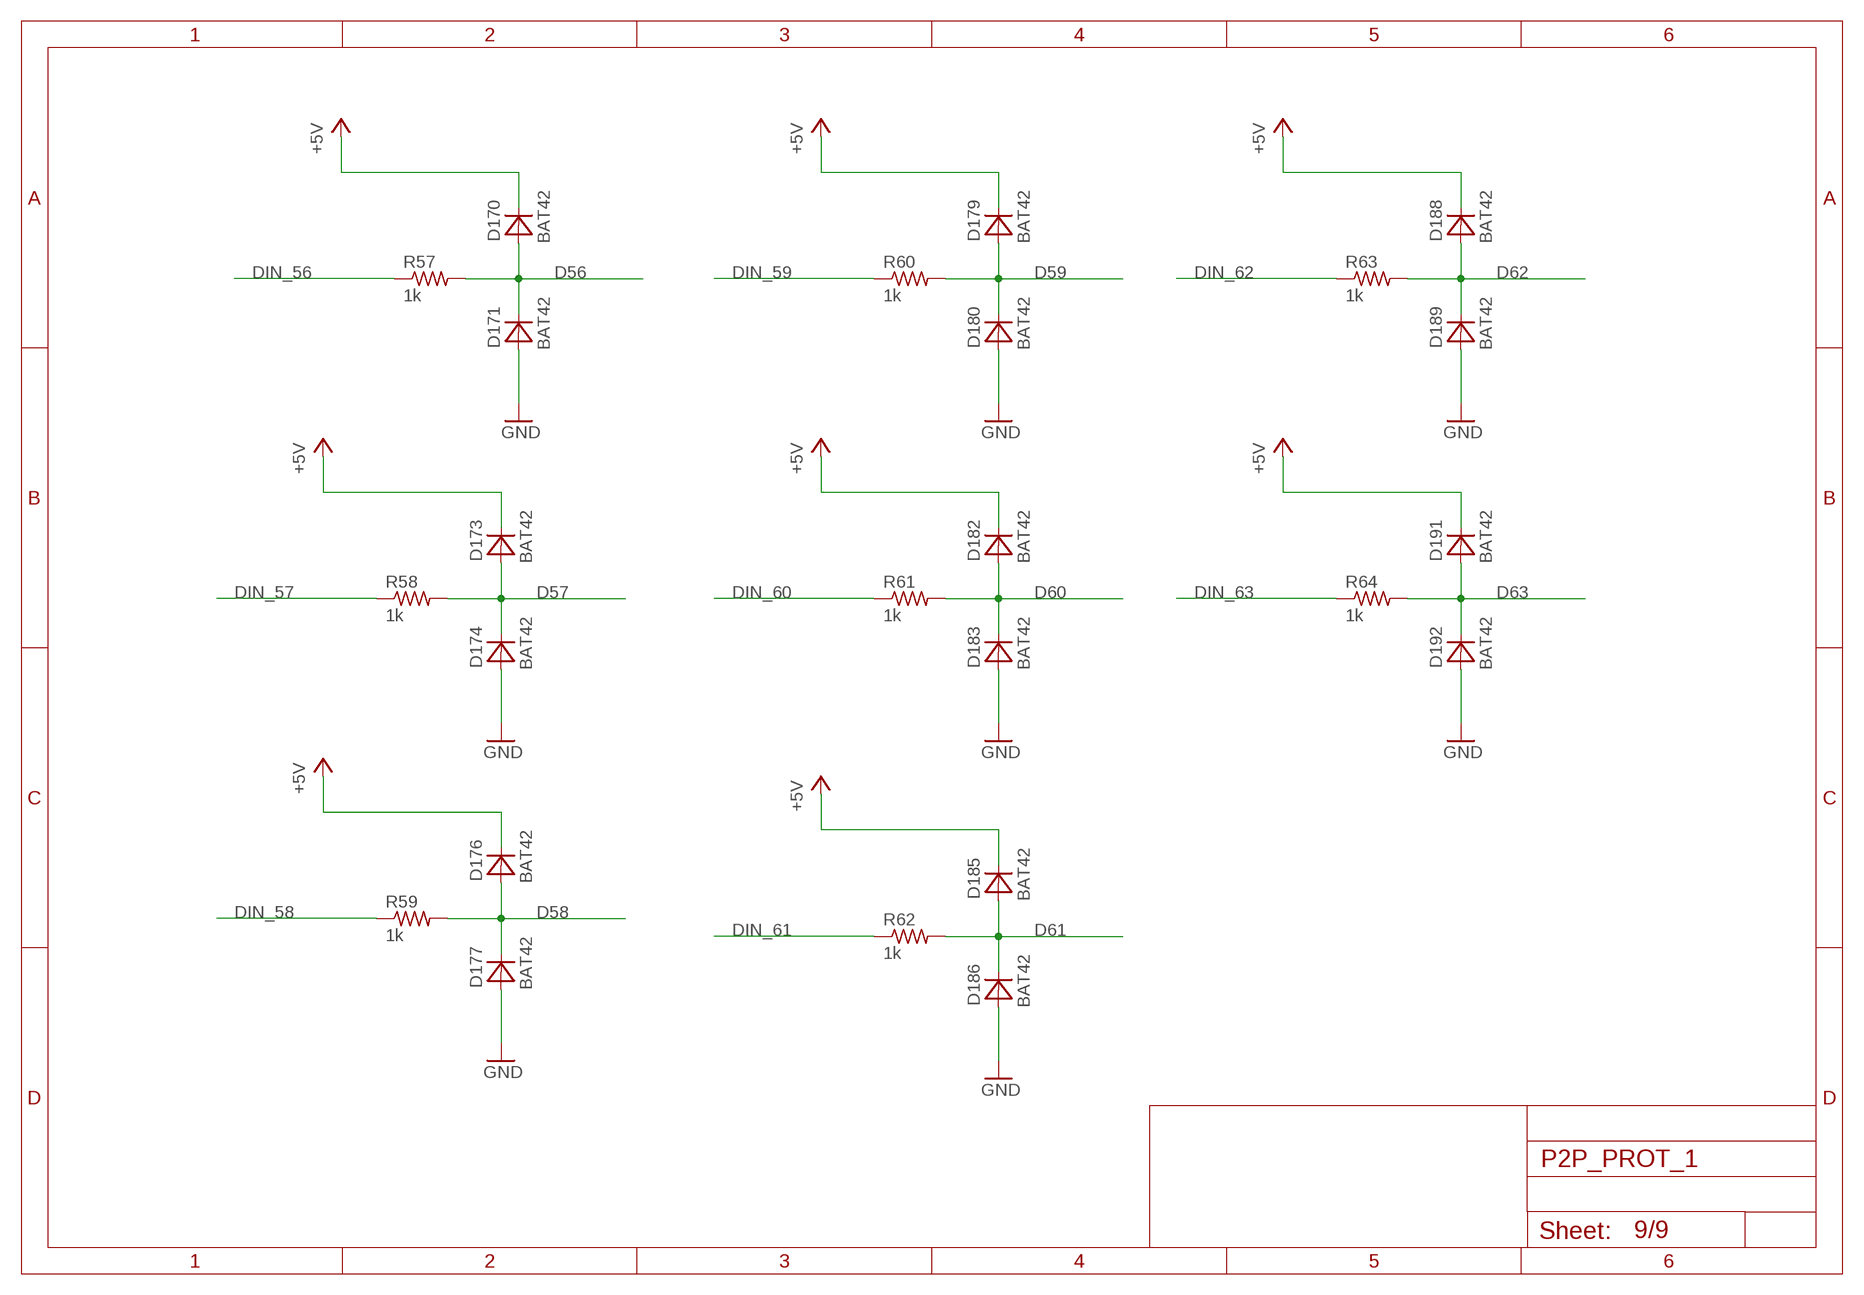
[diagram p8: schematic, sheet 9]

### Parts
D170  BAT42  [DO34-5]
D171  BAT42  [DO34-5]
D173  BAT42  [DO34-5]
D174  BAT42  [DO34-5]
D176  BAT42  [DO34-5]
D177  BAT42  [DO34-5]
D179  BAT42  [DO34-5]
D180  BAT42  [DO34-5]
D182  BAT42  [DO34-5]
D183  BAT42  [DO34-5]
D185  BAT42  [DO34-5]
D186  BAT42  [DO34-5]
D188  BAT42  [DO34-5]
D189  BAT42  [DO34-5]
D191  BAT42  [DO34-5]
D192  BAT42  [DO34-5]
R57  1k  R_P2INCH  [R_P2INCH]
R58  1k  R_P2INCH  [R_P2INCH]
R59  1k  R_P2INCH  [R_P2INCH]
R60  1k  R_P2INCH  [R_P2INCH]
R61  1k  R_P2INCH  [R_P2INCH]
R62  1k  R_P2INCH  [R_P2INCH]
R63  1k  R_P2INCH  [R_P2INCH]
R64  1k  R_P2INCH  [R_P2INCH]

### Nets
+5V: D170.C D173.C D176.C D179.C D182.C D185.C D188.C D191.C ; also sheet 1,2,3,4,5,6,7,8
D56: D170.A D171.C R57.2 ; also sheet 1
D57: D173.A D174.C R58.2 ; also sheet 1
D58: D176.A D177.C R59.2 ; also sheet 1
D59: D179.A D180.C R60.2 ; also sheet 1
D60: D182.A D183.C R61.2 ; also sheet 1
D61: D185.A D186.C R62.2 ; also sheet 1
D62: D188.A D189.C R63.2 ; also sheet 1
D63: D191.A D192.C R64.2 ; also sheet 1
DIN_56: R57.1 ; also sheet 1
DIN_57: R58.1 ; also sheet 1
DIN_58: R59.1 ; also sheet 1
DIN_59: R60.1 ; also sheet 1
DIN_60: R61.1 ; also sheet 1
DIN_61: R62.1 ; also sheet 1
DIN_62: R63.1 ; also sheet 1
DIN_63: R64.1 ; also sheet 1
GND: D171.A D174.A D177.A D180.A D183.A D186.A D189.A D192.A ; also sheet 1,2,3,4,5,6,7,8

## Library data of the parts
C1-C4 = MyLib:C_P2INCH
D2 D3 D5 D6 D8 D9 D11 D12 D14 D15 D17 D18 D20 D21 D23 D24 D26 D27 D29 D30 D32 D33 D35 D36 D38 D39 D41 D42 D44 D45 D47 D48 D50 D51 D53 D54 D56 D57 D59 D60 D62 D63 D65 D66 D68 D69 D71 D72 D74 D75 D77 D78 D80 D81 D83 D84 D86 D87 D89 D90 D92 D93 D95 D96 D98 D99 D101 D102 D104 D105 D107 D108 D110 D111 D113 D114 D116 D117 D119 D120 D122 D123 D125 D126 D128 D129 D131 D132 D134 D135 D137 D138 D140 D141 D143 D144 D146 D147 D149 D150 D152 D153 D155 D156 D158 D159 D161 D162 D164 D165 D167 D168 D170 D171 D173 D174 D176 D177 D179 D180 D182 D183 D185 D186 D188 D189 D191 D192 = MyLib:BAT42
J1-J4 = MyLib:20_HDR_LOCKING
J5 = MyLib:64_HDR_LOCKING
PP1-PP6 = MyLib:POWER_PAD
R1-R65 = MyLib:R_P2INCH
U$1-U$4 = MyLib:5P5_MOUNT_HOLE

## Board
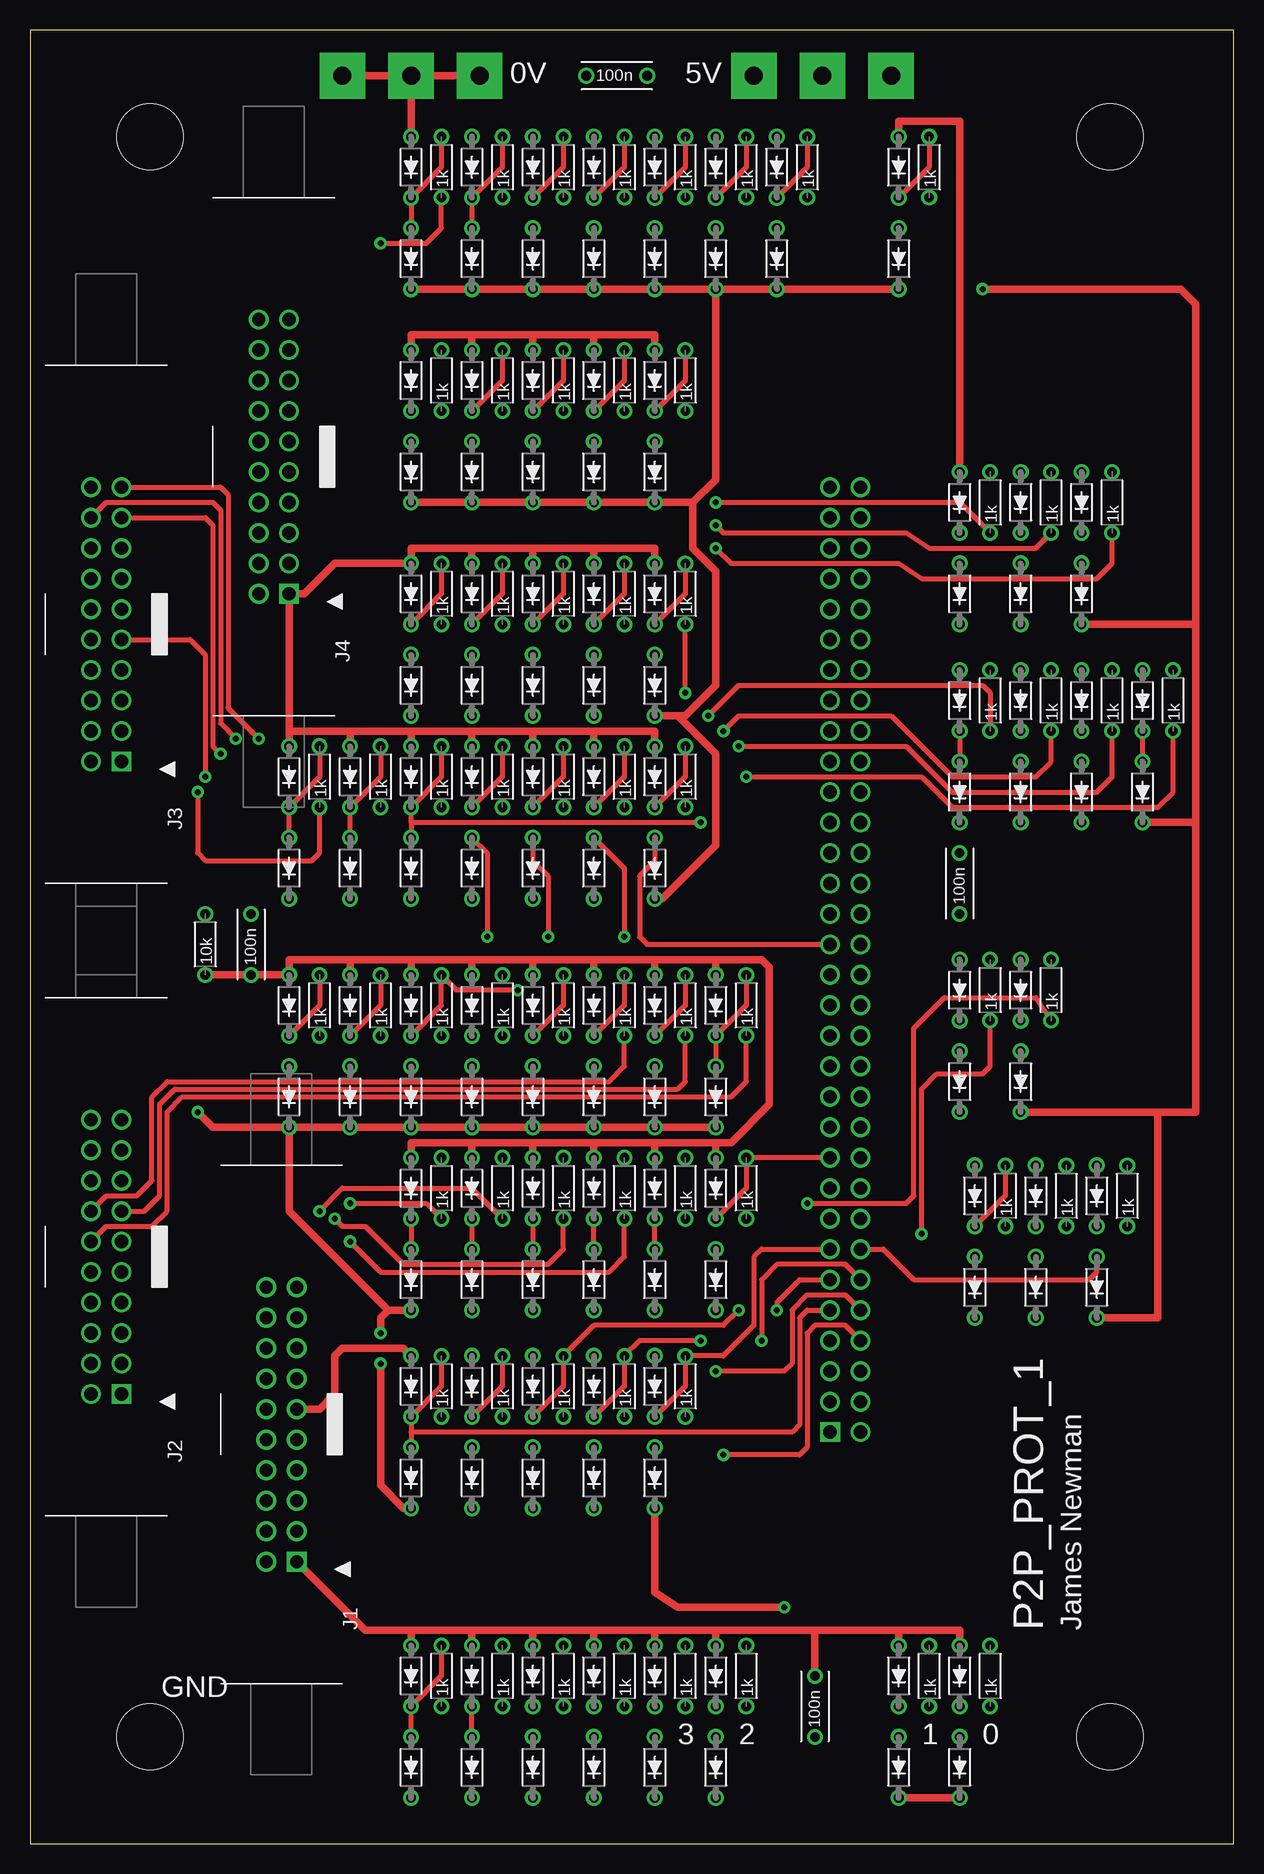
[diagram p9: board, top side]
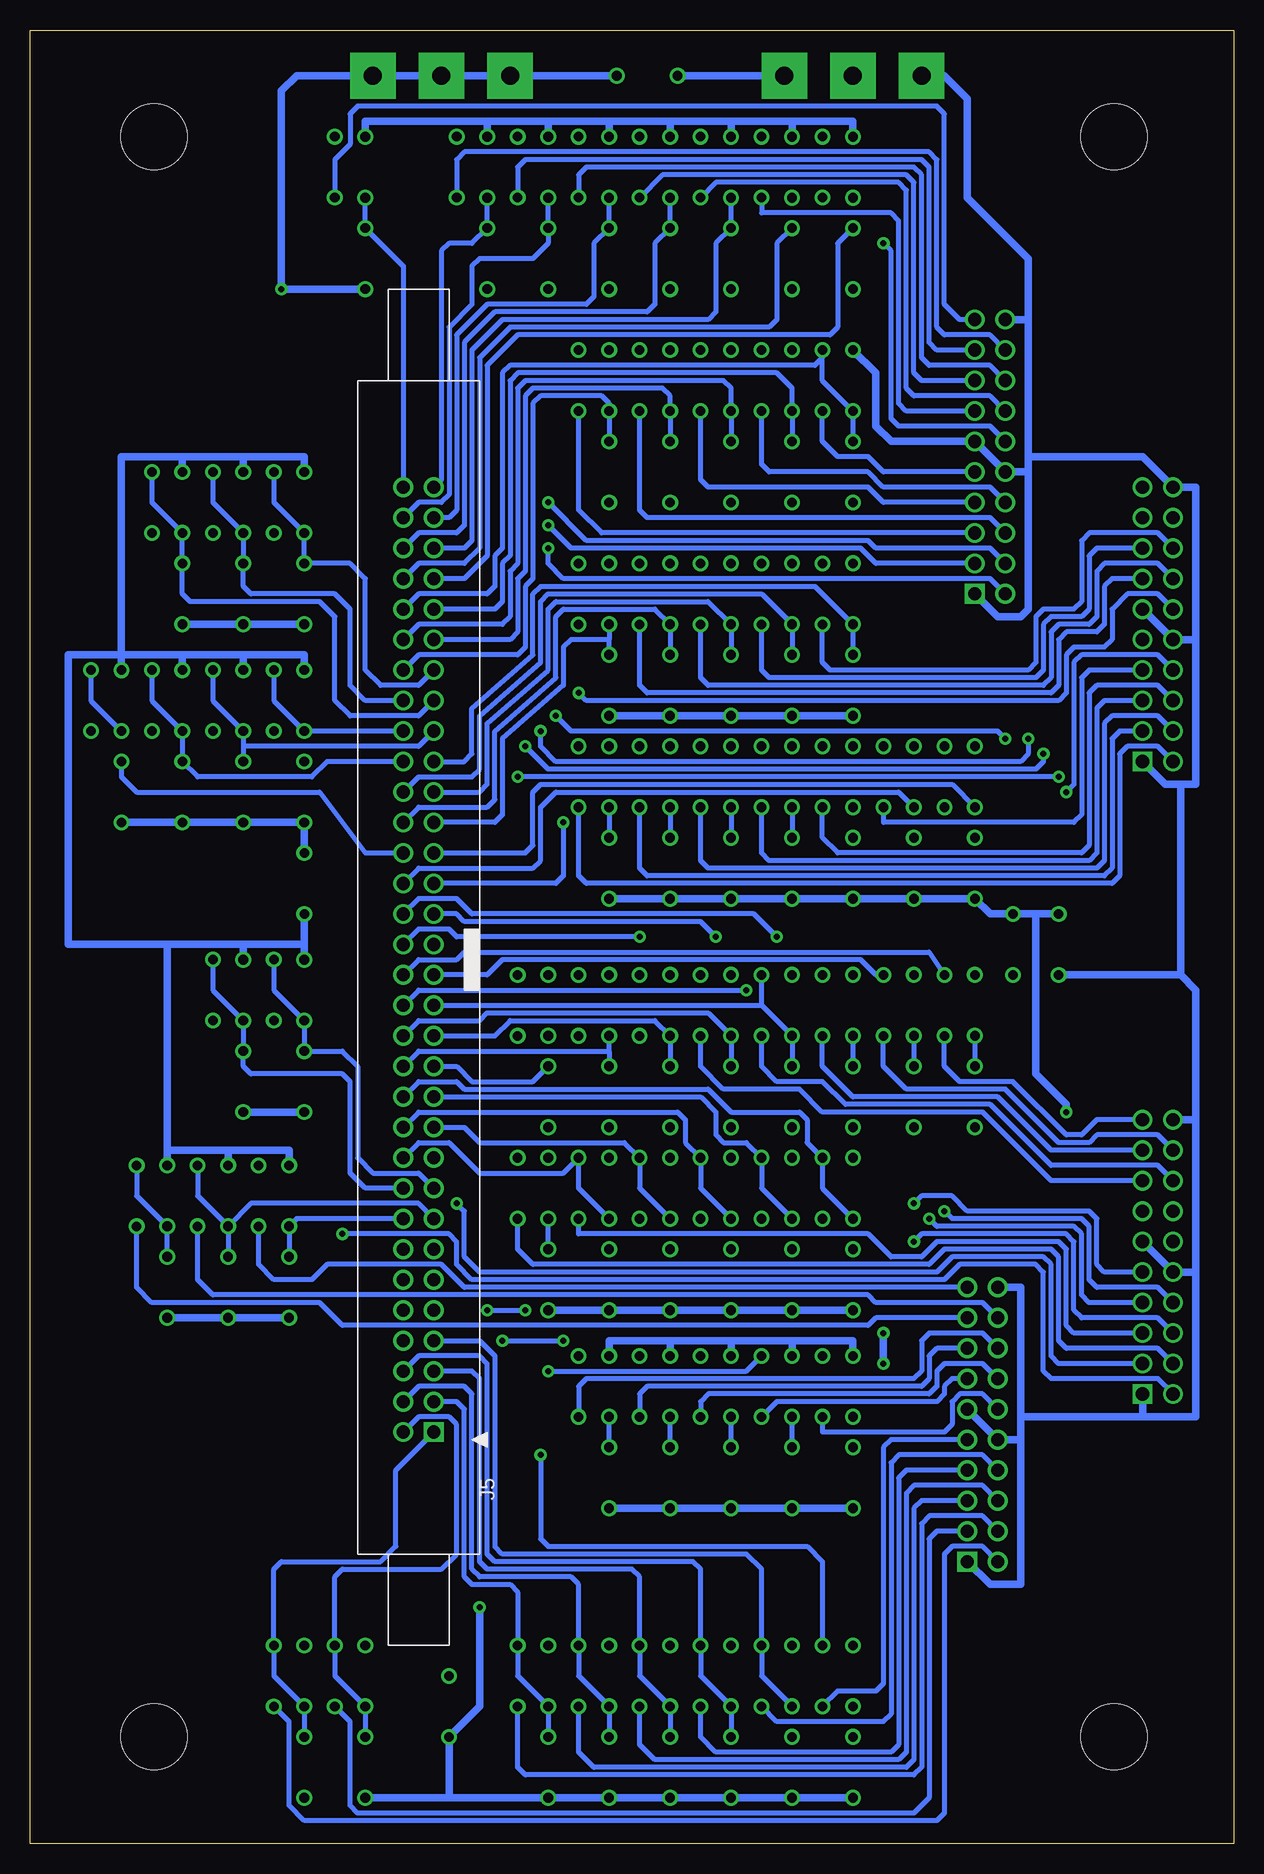
[diagram p10: board, bottom side, seen from below]

Size 100.33 x 151.13 mm. Coordinates in mm from the lower left corner, seen from the top.
Outline: 100.33,151.13 0,151.13 0,0 100.33,0 100.33,151.13
Copper layers (1*16): Top 0.035mm / dielectric 1.5mm / Bottom 0.035mm
Design rules "processor_rules_2layer *": minimum track width 8mil, minimum drill 14mil, track to track 8mil, track to pad 8mil, pad to pad 8mil, via to via 8mil, smd to smd 8mil, copper to edge 40mil, drill to drill 8mil, minimum pad ring 10mil, minimum via ring 8mil, stop-mask expansion 4mil, vias tented up to drill 20mil, thermal gap 10mil

### Footprints (pad centres in the part's own frame; a part is rotated, then mirrored left to right if it is on the bottom)
CAP_P2INCH = drill 0.8: 1 -2.54,0; 2 2.54,0
DO34-5 = drill 0.813: A 2.54,0; C -2.54,0
20_HDR_LOCKING = drill 1.1 square: 1 -1.27,11.43 | drill 1.1: 2 1.27,11.43; 3 -1.27,8.89; 4 1.27,8.89; 5 -1.27,6.35; 6 1.27,6.35; 7 -1.27,3.81; 8 1.27,3.81; 9 -1.27,1.27; 10 1.27,1.27; 11 -1.27,-1.27; 12 1.27,-1.27; 13 -1.27,-3.81; 14 1.27,-3.81; 15 -1.27,-6.35; 16 1.27,-6.35; 17 -1.27,-8.89; 18 1.27,-8.89; 19 -1.27,-11.43; 20 1.27,-11.43
64_HDR_LOCKING = drill 1.1 square: 1 -39.37,-1.27 | drill 1.1: 2 -39.37,1.27; 3 -36.83,-1.27; 4 -36.83,1.27; 5 -34.29,-1.27; 6 -34.29,1.27; 7 -31.75,-1.27; 8 -31.75,1.27; 9 -29.21,-1.27; 10 -29.21,1.27; 11 -26.67,-1.27; 12 -26.67,1.27; 13 -24.13,-1.27; 14 -24.13,1.27; 15 -21.59,-1.27; 16 -21.59,1.27; 17 -19.05,-1.27; 18 -19.05,1.27; 19 -16.51,-1.27; 20 -16.51,1.27; 21 -13.97,-1.27; 22 -13.97,1.27; 23 -11.43,-1.27; 24 -11.43,1.27; 25 -8.89,-1.27; 26 -8.89,1.27; 27 -6.35,-1.27; 28 -6.35,1.27; 29 -3.81,-1.27; 30 -3.81,1.27; 31 -1.27,-1.27; 32 -1.27,1.27; 33 1.27,-1.27; 34 1.27,1.27; 35 3.81,-1.27; 36 3.81,1.27; 37 6.35,-1.27; 38 6.35,1.27; 39 8.89,-1.27; 40 8.89,1.27; 41 11.43,-1.27; 42 11.43,1.27; 43 13.97,-1.27; 44 13.97,1.27; 45 16.51,-1.27; 46 16.51,1.27; 47 19.05,-1.27; 48 19.05,1.27; 49 21.59,-1.27; 50 21.59,1.27; 51 24.13,-1.27; 52 24.13,1.27; 53 26.67,-1.27; 54 26.67,1.27; 55 29.21,-1.27; 56 29.21,1.27; 57 31.75,-1.27; 58 31.75,1.27; 59 34.29,-1.27; 60 34.29,1.27; 61 36.83,-1.27; 62 36.83,1.27; 63 39.37,-1.27; 64 39.37,1.27
POWER_PAD = drill 1.5 pad 3.81 square: 1 0,0
R_P2INCH = drill 0.8: 1 -2.54,0; 2 2.54,0
5P5M_HOLE = hole 5.5: 0,0

### Placement (x,y rotation side)
C1  65.41,11.43 90 top
C2  18.41,74.93 90 top
C3  77.47,80.01 90 top
C4  48.9,147.32 0 top
D2  77.47,6.35 90 top
D3  77.47,13.97 90 top
D5  72.39,6.35 90 top
D6  72.39,13.97 90 top
D8  57.15,6.35 90 top
D9  57.15,13.97 90 top
D11  52.07,6.35 90 top
D12  52.07,13.97 90 top
D14  46.99,6.35 90 top
D15  46.99,13.97 90 top
D17  41.91,6.35 90 top
D18  41.91,13.97 90 top
D20  36.83,6.35 90 top
D21  36.83,13.97 90 top
D23  31.75,6.35 90 top
D24  31.75,13.97 90 top
D26  31.75,30.48 90 top
D27  31.75,38.1 90 top
D29  36.83,30.48 90 top
D30  36.83,38.1 90 top
D32  41.91,30.48 90 top
D33  41.91,38.1 90 top
D35  46.99,30.48 90 top
D36  46.99,38.1 90 top
D38  52.07,30.48 90 top
D39  52.07,38.1 90 top
D41  88.9,46.35 90 top
D42  88.9,53.98 90 top
D44  83.82,46.35 90 top
D45  83.82,53.98 90 top
D47  78.74,46.35 90 top
D48  78.74,53.98 90 top
D50  77.47,63.5 90 top
D51  77.47,71.12 90 top
D53  82.55,63.5 90 top
D54  82.55,71.12 90 top
D56  57.15,46.99 90 top
D57  57.15,54.61 90 top
D59  52.07,46.99 90 top
D60  52.07,54.61 90 top
D62  46.99,46.99 90 top
D63  46.99,54.61 90 top
D65  41.91,46.99 90 top
D66  41.91,54.61 90 top
D68  36.83,46.99 90 top
D69  36.83,54.61 90 top
D71  31.75,46.99 90 top
D72  31.75,54.61 90 top
D74  57.15,62.23 90 top
D75  57.15,69.85 90 top
D77  52.07,62.23 90 top
D78  52.07,69.85 90 top
D80  46.99,62.23 90 top
D81  46.99,69.85 90 top
D83  41.91,62.23 90 top
D84  41.91,69.85 90 top
D86  36.83,62.23 90 top
D87  36.83,69.85 90 top
D89  31.75,62.23 90 top
D90  31.75,69.85 90 top
D92  26.67,62.23 90 top
D93  26.67,69.85 90 top
D95  21.59,62.23 90 top
D96  21.59,69.85 90 top
D98  52.07,81.28 90 top
D99  52.07,88.9 90 top
D101  46.99,81.28 90 top
D102  46.99,88.9 90 top
D104  41.91,81.28 90 top
D105  41.91,88.9 90 top
D107  36.83,81.28 90 top
D108  36.83,88.9 90 top
D110  31.75,81.28 90 top
D111  31.75,88.9 90 top
D113  26.67,81.28 90 top
D114  26.67,88.9 90 top
D116  21.59,81.28 90 top
D117  21.59,88.9 90 top
D119  92.71,87.63 90 top
D120  92.71,95.25 90 top
D122  52.07,96.52 90 top
D123  52.07,104.14 90 top
D125  46.99,96.52 90 top
D126  46.99,104.14 90 top
D128  41.91,96.52 90 top
D129  41.91,104.14 90 top
D131  36.83,96.52 90 top
D132  36.83,104.14 90 top
D134  31.75,96.52 90 top
D135  31.75,104.14 90 top
D137  87.63,87.63 90 top
D138  87.63,95.25 90 top
D140  82.55,87.63 90 top
D141  82.55,95.25 90 top
D143  77.47,87.63 90 top
D144  77.47,95.25 90 top
D146  87.63,104.14 90 top
D147  87.63,111.76 90 top
D149  82.55,104.14 90 top
D150  82.55,111.76 90 top
D152  77.47,104.14 90 top
D153  77.47,111.76 90 top
D155  52.07,114.3 90 top
D156  52.07,121.92 90 top
D158  46.99,114.3 90 top
D159  46.99,121.92 90 top
D161  41.91,114.3 90 top
D162  41.91,121.92 90 top
D164  36.83,114.3 90 top
D165  36.83,121.92 90 top
D167  31.75,114.3 90 top
D168  31.75,121.92 90 top
D170  31.75,132.08 90 top
D171  31.75,139.7 90 top
D173  36.83,132.08 90 top
D174  36.83,139.7 90 top
D176  41.91,132.08 90 top
D177  41.91,139.7 90 top
D179  46.99,132.08 90 top
D180  46.99,139.7 90 top
D182  52.07,132.08 90 top
D183  52.07,139.7 90 top
D185  57.15,132.08 90 top
D186  57.15,139.7 90 top
D188  62.23,132.08 90 top
D189  62.23,139.7 90 top
D191  72.39,132.08 90 top
D192  72.39,139.7 90 top
J1  20.95,34.92 180 top
J2  6.35,48.9 180 top
J3  6.35,101.6 180 top
J4  20.32,115.57 180 top
J5  67.94,73.66 90 bottom
PP1  60.33,147.32 0 top
PP2  66.04,147.32 0 top
PP3  71.75,147.32 0 top
PP4  37.47,147.32 0 top
PP5  31.75,147.32 0 top
PP6  26.04,147.32 0 top
R1  80.01,13.97 90 top
R2  74.93,13.97 90 top
R3  59.69,13.97 90 top
R4  54.61,13.97 90 top
R5  49.53,13.97 90 top
R6  44.45,13.97 90 top
R7  39.37,13.97 90 top
R8  34.29,13.97 90 top
R9  34.29,38.1 90 top
R10  39.37,38.1 90 top
R11  44.45,38.1 90 top
R12  49.53,38.1 90 top
R13  54.61,38.1 90 top
R14  91.44,53.98 90 top
R15  86.36,53.98 90 top
R16  81.28,53.98 90 top
R17  80.01,71.12 90 top
R18  85.09,71.12 90 top
R19  59.69,54.61 90 top
R20  54.61,54.61 90 top
R21  49.53,54.61 90 top
R22  44.45,54.61 90 top
R23  39.37,54.61 90 top
R24  34.29,54.61 90 top
R25  59.69,69.85 90 top
R26  54.61,69.85 90 top
R27  49.53,69.85 90 top
R28  44.45,69.85 90 top
R29  39.37,69.85 90 top
R30  34.29,69.85 90 top
R31  29.21,69.85 90 top
R32  24.13,69.85 90 top
R33  54.61,88.9 90 top
R34  49.53,88.9 90 top
R35  44.45,88.9 90 top
R36  39.37,88.9 90 top
R37  34.29,88.9 90 top
R38  29.21,88.9 90 top
R39  24.13,88.9 90 top
R40  95.25,95.25 90 top
R41  54.61,104.14 90 top
R42  49.53,104.14 90 top
R43  44.45,104.14 90 top
R44  39.37,104.14 90 top
R45  34.29,104.14 90 top
R46  90.17,95.25 90 top
R47  85.09,95.25 90 top
R48  80.01,95.25 90 top
R49  90.17,111.76 90 top
R50  85.09,111.76 90 top
R51  80.01,111.76 90 top
R52  54.61,121.92 90 top
R53  49.53,121.92 90 top
R54  44.45,121.92 90 top
R55  39.37,121.92 90 top
R56  34.29,121.92 90 top
R57  34.29,139.7 90 top
R58  39.37,139.7 90 top
R59  44.45,139.7 90 top
R60  49.53,139.7 90 top
R61  54.61,139.7 90 top
R62  59.69,139.7 90 top
R63  64.77,139.7 90 top
R64  74.93,139.7 90 top
R65  14.61,74.93 90 top
U$1  90,8.89 180 top
U$2  90,142.24 180 top
U$3  10,142.24 0 top
U$4  10,8.89 180 top

### Tracks (layer width: path | path; a pad name or v marks a point on that pad's centre or on a via)
+5V  (via drill 0.5 pad 1.02)
  Top 0.61: D5.C D2.C | D95.C D92.C D89.C D86.C D83.C D80.C D77.C D74.C | D167.C D164.C D161.C D158.C D155.C 55.24,111.76 | D170.C D173.C D176.C D179.C D182.C D185.C | D185.C D188.C D191.C | D95.C 15.24,59.69 v13.97,60.96 | D38.C 52.07,20.95 53.98,19.68 v62.87,19.68 | D53.C 93.98,60.96 | 93.98,60.96 93.98,43.81 D41.C | D146.C 97.16,101.6 | 97.16,101.6 97.16,85.09 | 97.16,85.09 97.16,60.96 93.98,60.96 | 97.16,85.09 D119.C | 55.24,111.76 57.15,113.67 D185.C | D98.C 52.7,78.74 57.15,83.19 57.15,90.81 53.98,93.98 | 53.98,93.98 D122.C | D71.C 29.84,44.45 | 29.84,44.45 21.59,52.7 D95.C | 97.16,101.6 97.16,128.27 95.89,129.54 v79.38,129.54 | 55.24,111.76 55.24,107.95 57.15,106.05 57.15,96.52 54.61,93.98 53.98,93.98 | D26.C 31.11,27.94 29.21,29.84 v29.21,40.01 | v29.21,42.55 29.21,43.81 29.84,44.45
  Bottom 0.61: D23.C D20.C D17.C D14.C D11.C D8.C 65.41,3.81 | 65.41,3.81 D5.C | 65.41,3.81 C1.1 62.87,11.43 v62.87,19.68 | D26.C D29.C D32.C D35.C D38.C | D71.C D68.C D65.C D62.C D59.C D56.C | R65.2 16.51,77.47 | 16.51,77.47 C2.2 20.32,77.47 D116.C D113.C D110.C D107.C D104.C D101.C D98.C | D134.C D131.C D128.C D125.C D122.C | C4.2 PP1.1 PP2.1 PP3.1 78.11,147.32 79.38,146.05 v79.38,129.54 D191.C | D152.C D149.C D146.C | D119.C D137.C D140.C D143.C C3.2 | D50.C D53.C | D47.C D44.C D41.C | v13.97,60.96 13.97,61.59 16.51,64.14 16.51,77.47 | v29.21,40.01 v29.21,42.55
D0
  Bottom 0.406: J5.1 69.85,31.11 69.85,24.77 71.12,23.5 79.38,23.5 80.01,22.86 R1.2 80.01,13.97 D3.C D2.A
D1
  Bottom 0.406: J5.2 67.94,35.56 65.41,35.56 64.77,34.92 64.77,24.13 66.04,22.86 74.3,22.86 74.93,22.23 R2.2 74.93,13.97 D6.C D5.A
D2
  Bottom 0.406: J5.3 64.77,36.83 64.14,36.2 64.14,22.23 63.5,21.59 60.33,21.59 59.69,20.95 R3.2 59.69,13.97 D9.C D8.A
D3
  Bottom 0.406: J5.4 67.94,38.1 64.14,38.1 63.5,37.47 63.5,22.86 62.87,22.23 55.24,22.23 54.61,21.59 R4.2 54.61,13.97 D12.C D11.A
D4
  Bottom 0.406: J5.5 63.5,39.37 62.87,38.73 62.87,23.5 62.23,22.86 50.16,22.86 49.53,22.23 R5.2 49.53,13.97 D15.C D14.A
D5
  Bottom 0.406: J5.6 67.94,40.64 62.87,40.64 62.23,40.01 62.23,24.13 61.59,23.5 45.09,23.5 44.45,22.86 R6.2 44.45,13.97 D18.C D17.A
D6
  Top 0.406: D20.A D21.C
  Bottom 0.406: J5.7 62.87,41.91 61.59,40.64 61.59,24.77 60.96,24.13 40.64,24.13 39.37,22.86 R7.2 39.37,13.97 D21.C
D7  (via drill 0.5 pad 1.02)
  Top 0.406: J5.8 67.94,43.18 65.41,43.18 64.77,42.55 64.77,33.02 64.14,32.38 v57.78,32.38 | R8.2 34.29,13.97 D24.C D23.A
  Bottom 0.406: v57.78,32.38 57.78,25.4 57.15,24.77 35.56,24.77 34.29,23.5 R8.2
D8
  Top 0.406: J5.9 64.77,44.45 64.14,43.81 64.14,34.92 63.5,34.29 31.75,34.29 | 31.75,34.29 D26.A | R9.2 34.29,38.1 D27.C 31.75,34.29
D9  (via drill 0.5 pad 1.02)
  Top 0.406: J5.10 67.94,45.72 64.77,45.72 63.5,44.45 63.5,40.01 62.87,39.37 v57.15,39.37 | R10.2 39.37,38.1 D30.C
  Bottom 0.406: D29.A D30.C | v57.15,39.37 40.64,39.37 R10.2
D10  (via drill 0.5 pad 1.02)
  Top 0.406: J5.11 64.14,46.99 62.23,45.09 v62.23,44.45 | D33.C 44.45,38.1 R11.2 46.99,43.18 57.78,43.18 v59.05,44.45
  Bottom 0.406: D32.A D33.C | v62.23,44.45 v59.05,44.45
D11  (via drill 0.5 pad 1.02)
  Top 0.406: D36.C 49.53,38.1 R12.2 50.8,41.91 v55.88,41.91 | J5.12 67.94,48.26 62.23,48.26 60.96,46.99 v60.96,41.91
  Bottom 0.406: D35.A D36.C | v60.96,41.91 v55.88,41.91
D12
  Top 0.406: J5.13 60.96,49.53 60.33,48.9 60.33,43.18 57.78,40.64 R13.2 54.61,38.1 D39.C
  Bottom 0.406: D38.A D39.C
D13
  Top 0.406: J5.14 71.12,49.53 73.66,46.99 88.27,46.99 88.9,47.62 D41.A
  Bottom 0.406: D41.A D42.C 91.44,53.98 R14.2
D14
  Bottom 0.406: J5.15 67.94,53.34 81.92,53.34 D45.C | R15.2 86.36,53.98 D45.C | D45.C D44.A
D15
  Top 0.406: R16.2 81.28,53.98 D48.C
  Bottom 0.406: J5.16 78.11,52.07 D48.C D47.A
D16
  Bottom 0.406: R17.2 80.01,71.12 D51.C D50.A 74.3,66.04 73.03,64.77 73.03,57.15 71.75,55.88 67.94,55.88 J5.17
D17
  Bottom 0.406: R18.2 85.09,71.12 D54.C D53.A 82.55,64.77 81.92,64.14 74.3,64.14 73.66,63.5 73.66,55.88 72.39,54.61 J5.18
D18
  Top 0.406: J5.19 R19.2 59.69,54.61 D57.C
  Bottom 0.406: D56.A D57.C
D19
  Top 0.406: D59.A D60.C
  Bottom 0.406: J5.20 67.94,58.42 65.41,58.42 62.87,55.88 55.88,55.88 R20.2 54.61,54.61 D60.C
D20
  Top 0.406: D62.A D63.C
  Bottom 0.406: J5.21 64.14,59.69 62.87,58.42 50.8,58.42 R21.2 49.53,54.61 D63.C
D21
  Top 0.406: D66.C D65.A
  Bottom 0.406: J5.22 67.94,60.96 46.35,60.96 45.72,60.33 45.72,58.42 R22.2 44.45,54.61 D66.C
D22
  Top 0.406: D69.C D68.A
  Bottom 0.406: J5.23 44.45,62.23 43.18,60.96 43.18,59.05 42.55,58.42 40.64,58.42 R23.2 39.37,54.61 D69.C
D23
  Top 0.406: D72.C D71.A
  Bottom 0.406: J5.24 67.94,63.5 64.77,63.5 64.14,62.87 43.81,62.87 41.91,60.96 36.2,60.96 35.56,60.33 35.56,58.42 R24.2 34.29,54.61 D72.C
D24
  Top 0.406: D74.A D75.C 59.69,69.85 R25.2
  Bottom 0.406: J5.25 64.77,64.77 63.5,63.5 58.42,63.5 D74.A
D25
  Top 0.406: R26.2 54.61,69.85 D78.C
  Bottom 0.406: J5.26 67.94,66.04 52.07,66.04 | 52.07,66.04 D77.A | 52.07,66.04 D78.C
D26
  Top 0.406: R27.2 49.53,69.85 D81.C
  Bottom 0.406: J5.27 61.59,67.31 60.33,68.58 48.26,68.58 D81.C D80.A
D27
  Top 0.406: R28.2 44.45,69.85 D84.C
  Bottom 0.406: J5.28 67.94,68.58 62.87,68.58 62.23,69.22 43.81,69.22 D84.C D83.A
D28
  Bottom 0.406: J5.29 39.37,69.85 | 39.37,69.85 R29.2 | 39.37,69.85 D87.C D86.A
D29  (via drill 0.5 pad 1.02)
  Top 0.406: v40.64,71.12 35.56,71.12 R30.2 34.29,69.85 D90.C
  Bottom 0.406: J5.30 67.94,71.12 v40.64,71.12 | D90.C D89.A
D30
  Top 0.406: R31.2 29.21,69.85 D93.C
  Bottom 0.406: R31.2 29.84,72.39 31.11,73.66 60.96,73.66 62.23,72.39 J5.31 | D93.C D92.A
D31
  Top 0.406: R32.2 24.13,69.85 D96.C
  Bottom 0.406: J5.32 67.94,73.66 64.77,73.66 64.14,74.3 25.4,74.3 R32.2 | D96.C D95.A
D32
  Top 0.406: D98.A 52.07,81.92 50.8,80.64 50.8,75.56 51.44,74.93 J5.33 | R33.2 54.61,88.9 D99.C
  Bottom 0.406: D99.C D98.A
D33  (via drill 0.5 pad 1.02)
  Top 0.406: D101.A 49.53,81.28 v49.53,75.56 | R34.2 49.53,88.9 D102.C
  Bottom 0.406: v49.53,75.56 64.77,75.56 65.41,76.2 67.94,76.2 J5.34 | D102.C D101.A
D34  (via drill 0.5 pad 1.02)
  Top 0.406: D104.A 41.91,81.92 43.18,80.64 v43.18,75.56 | R35.2 44.45,88.9 D105.C
  Bottom 0.406: v43.18,75.56 44.45,76.83 64.14,76.83 64.77,77.47 J5.35 | D105.C D104.A
D35  (via drill 0.5 pad 1.02)
  Top 0.406: D107.A 38.1,82.55 v38.1,75.56 | R36.2 39.37,88.9 D108.C
  Bottom 0.406: v38.1,75.56 40.01,77.47 63.5,77.47 64.77,78.74 67.94,78.74 J5.36 | D108.C D107.A
D36  (via drill 0.5 pad 1.02)
  Top 0.406: 31.75,85.09 v55.88,85.09 | R37.2 34.29,88.9 D111.C 31.75,85.09 | 31.75,85.09 D110.A
  Bottom 0.406: v55.88,85.09 55.88,80.64 56.52,80.01 J5.37
D37
  Top 0.406: D113.A D114.C 29.21,88.9 R38.2
  Bottom 0.406: J5.38 67.94,81.28 58.42,81.28 57.78,81.92 57.78,86.36 56.52,87.63 27.94,87.63 D114.C
D38
  Top 0.406: D116.A D117.C 24.13,88.9 R39.2
  Bottom 0.406: J5.39 59.05,82.55 58.42,83.19 58.42,87.63 57.78,88.27 23.5,88.27 D117.C
D39
  Top 0.406: D119.A D120.C
  Bottom 0.406: R40.2 95.25,95.25 D120.C | D119.A 92.71,88.9 91.44,87.63 76.2,87.63 72.39,82.55 J5.40
D40
  Top 0.406: R41.2 54.61,104.14 D123.C
  Bottom 0.406: D123.C 52.07,100.33 | 52.07,100.33 55.24,100.33 55.88,99.69 55.88,96.52 60.96,92.08 60.96,85.72 61.59,85.09 J5.41 | D122.A 52.07,100.33
D41
  Top 0.406: R42.2 49.53,104.14 D126.C
  Bottom 0.406: J5.42 67.94,86.36 62.23,86.36 61.59,87 61.59,92.71 56.52,97.16 56.52,102.23 55.88,102.87 48.26,102.87 D126.C D125.A
D42
  Top 0.406: R43.2 44.45,104.14 D129.C
  Bottom 0.406: J5.43 62.87,87.63 62.23,88.27 62.23,93.34 57.15,97.79 57.15,102.87 56.52,103.5 43.81,103.5 D129.C D128.A
D43
  Top 0.406: R44.2 39.37,104.14 D132.C
  Bottom 0.406: J5.44 67.94,88.9 63.5,88.9 62.87,89.53 62.87,93.98 57.78,98.42 57.78,103.5 57.15,104.14 39.37,104.14 D132.C D131.A
D44
  Top 0.406: R45.2 34.29,104.14 D135.C
  Bottom 0.406: J5.45 64.14,90.17 63.5,90.81 63.5,94.61 58.42,99.06 58.42,104.14 57.78,104.78 34.92,104.78 D135.C D134.A
D45
  Bottom 0.406: J5.46 75.56,90.17 76.83,88.9 86.36,88.9 D137.A D138.C 90.17,95.25 R46.2
D46
  Bottom 0.406: J5.47 67.94,91.44 82.55,91.44 | 82.55,91.44 D140.A | R47.2 85.09,95.25 D141.C 82.55,91.44
D47
  Top 0.406: D144.C D143.A
  Bottom 0.406: J5.48 D144.C 80.01,95.25 R48.2
D48
  Bottom 0.406: J5.49 67.94,93.98 73.66,93.98 74.93,95.25 74.93,102.23 76.2,103.5 87,103.5 87.63,104.14 D146.A D147.C 90.17,111.76 R49.2
D49
  Bottom 0.406: J5.50 72.39,95.25 73.66,96.52 73.66,102.87 74.93,104.14 81.92,104.14 82.55,104.78 D149.A D150.C 85.09,111.76 R50.2
D50
  Bottom 0.406: J5.51 67.94,96.52 71.12,96.52 72.39,97.79 72.39,105.41 73.66,106.68 D152.A D153.C 80.01,111.76 R51.2
D51
  Top 0.406: R52.2 54.61,121.92 D156.C
  Bottom 0.406: J5.52 67.94,99.06 59.69,99.06 59.05,99.69 59.05,104.78 58.42,105.41 58.42,120.02 57.78,120.65 52.7,120.65 52.07,120.02 D156.C D155.A
D52
  Top 0.406: R53.2 49.53,121.92 D159.C
  Bottom 0.406: J5.53 60.33,100.33 59.69,100.97 59.69,105.41 59.05,106.05 59.05,120.65 58.42,121.28 47.62,121.28 46.99,120.65 D159.C D158.A
D53
  Top 0.406: R54.2 44.45,121.92 D162.C
  Bottom 0.406: J5.54 67.94,101.6 60.96,101.6 60.33,102.23 60.33,106.05 59.69,106.68 59.69,121.28 59.05,121.92 42.55,121.92 41.91,121.28 D162.C D161.A
D54
  Top 0.406: R55.2 39.37,121.92 D165.C
  Bottom 0.406: J5.55 61.59,102.87 60.96,103.5 60.96,106.68 60.33,107.31 60.33,121.92 59.69,122.56 38.1,122.56 36.83,121.28 D165.C D164.A
D55
  Bottom 0.406: R56.2 34.29,123.83 | 34.29,123.83 34.92,123.19 60.33,123.19 60.96,122.56 60.96,107.95 61.59,107.31 61.59,104.78 62.23,104.14 67.94,104.14 J5.56 | D167.A D168.C 34.29,121.92 34.29,123.83
D56
  Top 0.406: R57.2 34.29,139.7 D171.C D170.A
  Bottom 0.406: D170.A 33.02,133.35 33.02,126.36 33.66,125.73 59.69,125.73 62.23,123.19 62.23,107.31 64.14,105.41 J5.57
D57
  Top 0.406: R58.2 39.37,139.7 D174.C D173.A
  Bottom 0.406: D173.A 38.1,133.35 38.1,127 38.73,126.36 60.33,126.36 62.87,123.83 62.87,107.95 64.14,106.68 67.94,106.68 J5.58
D58
  Top 0.406: R59.2 44.45,139.7 D177.C
  Bottom 0.406: J5.59 64.14,107.95 63.5,108.58 63.5,124.46 60.96,127 43.81,127 43.18,127.64 43.18,133.35 D176.A D177.C
D59
  Top 0.406: R60.2 49.53,139.7 D180.C
  Bottom 0.406: J5.60 67.94,109.22 64.77,109.22 64.14,109.86 64.14,125.09 61.59,127.64 48.9,127.64 48.26,128.27 48.26,133.35 D179.A D180.C
D60
  Top 0.406: R61.2 54.61,139.7 D183.C
  Bottom 0.406: J5.61 65.41,110.49 64.77,111.12 64.77,125.73 62.23,128.27 53.98,128.27 53.34,128.91 53.34,133.35 D182.A D183.C
D61
  Top 0.406: R62.2 59.69,139.7 D186.C
  Bottom 0.406: J5.62 67.94,111.76 66.04,111.76 65.41,112.39 65.41,126.36 63.5,128.27 63.5,131.44 62.87,132.08 58.42,132.08 57.15,133.35 D185.A D186.C
D62
  Top 0.406: R63.2 64.77,139.7 D189.C
  Bottom 0.406: J5.63 66.04,113.67 66.04,132.72 65.41,133.35 63.5,133.35 D188.A D189.C
D63
  Top 0.406: R64.2 74.93,139.7 D192.C
  Bottom 0.406: J5.64 69.22,131.44 D191.A D192.C
DIN_0
  Bottom 0.406: J1.2 20.95,24.77 23.5,24.77 24.13,24.13 24.13,2.54 24.77,1.91 77.47,1.91 78.74,3.17 78.74,10.16 R1.1
DIN_1
  Bottom 0.406: J1.3 24.77,26.04 25.4,25.4 25.4,3.81 26.67,2.54 73.03,2.54 73.66,3.17 73.66,10.16 R2.1
DIN_2
  Bottom 0.406: J1.4 20.95,27.3 25.4,27.3 26.04,26.67 26.04,6.35 26.67,5.71 59.05,5.71 59.69,6.35 R3.1
DIN_3
  Bottom 0.406: J1.5 26.04,28.57 26.67,27.94 26.67,6.99 27.3,6.35 53.34,6.35 54.61,7.62 R4.1
DIN_4
  Bottom 0.406: J1.6 20.95,29.84 26.67,29.84 27.3,29.21 27.3,7.62 27.94,6.99 48.26,6.99 49.53,8.26 R5.1
DIN_5
  Bottom 0.406: J1.7 27.3,31.11 27.94,30.48 27.94,8.26 28.57,7.62 43.18,7.62 44.45,8.89 R6.1
DIN_6
  Bottom 0.406: J1.8 20.95,32.38 27.94,32.38 28.57,31.75 28.57,10.79 29.21,10.16 38.1,10.16 R7.1
DIN_7
  Bottom 0.406: R8.1 33.02,12.7 29.84,12.7 29.21,13.34 29.21,33.02 28.57,33.66 J1.9
DIN_8
  Bottom 0.406: J1.12 20.95,37.47 22.86,37.47 23.5,36.83 23.5,34.92 24.13,34.29 34.29,34.29 R9.1
DIN_9
  Bottom 0.406: J1.13 23.5,38.73 24.13,38.1 24.13,37.47 24.77,36.83 38.1,36.83 R10.1
DIN_10
  Bottom 0.406: J1.14 20.95,40.01 24.13,40.01 24.77,39.37 24.77,38.1 25.4,37.47 43.81,37.47 44.45,36.83 R11.1
DIN_11
  Bottom 0.406: J1.15 24.77,41.27 25.4,40.64 25.4,38.73 26.04,38.1 48.9,38.1 49.53,37.47 R12.1
DIN_12
  Bottom 0.406: J1.16 20.95,42.55 25.4,42.55 26.04,41.91 26.04,39.37 26.67,38.73 53.98,38.73 54.61,38.1 R13.1
DIN_13
  Bottom 0.406: J1.17 29.84,43.81 30.48,43.18 74.3,43.18 76.2,45.09 90.17,45.09 91.44,46.35 R14.1
DIN_14
  Bottom 0.406: J1.18 20.95,45.09 29.84,45.09 30.48,45.72 85.09,45.72 86.36,46.99 R15.1
DIN_15
  Bottom 0.406: J1.19 64.14,46.35 66.04,48.26 75.56,48.26 76.83,46.99 80.01,46.99 81.28,48.26 R16.1
DIN_16  (via drill 0.5 pad 1.02)
  Top 0.406: v74.3,50.8 74.3,62.87 75.56,64.14 79.38,64.14 80.01,64.77 R17.1
  Bottom 0.406: J2.2 6.35,38.73 15.24,38.73 15.88,39.37 15.88,47.62 16.51,48.26 22.86,48.26 24.13,46.99 63.5,46.99 64.77,48.26 64.77,50.16 65.41,50.8 v74.3,50.8
DIN_17  (via drill 0.5 pad 1.02)
  Top 0.406: v64.77,53.34 73.03,53.34 73.66,53.98 73.66,67.94 76.2,70.48 83.82,70.48 R18.1
  Bottom 0.406: J2.3 14.61,40.01 15.24,40.64 15.24,48.26 15.88,48.9 23.5,48.9 24.77,47.62 62.87,47.62 64.14,48.9 64.14,52.7 v64.77,53.34
DIN_18
  Bottom 0.406: J2.4 6.35,41.27 13.97,41.27 14.61,41.91 14.61,48.9 15.24,49.53 24.13,49.53 25.4,48.26 58.42,48.26 59.69,49.53 R19.1
DIN_19
  Bottom 0.406: J2.5 13.34,42.55 13.97,43.18 13.97,49.53 14.61,50.16 24.77,50.16 26.04,48.9 28.57,48.9 30.48,50.8 54.61,50.8 R20.1
DIN_20  (via drill 0.5 pad 1.02)
  Top 0.406: v26.67,50.16 29.21,47.62 48.26,47.62 49.53,48.9 R21.1
  Bottom 0.406: J2.6 6.35,43.81 12.7,43.81 13.34,44.45 13.34,50.16 13.97,50.8 26.04,50.8 v26.67,50.16
DIN_21  (via drill 0.5 pad 1.02)
  Top 0.406: v25.4,52.07 26.04,51.44 27.94,51.44 31.11,48.26 43.18,48.26 44.45,49.53 R22.1
  Bottom 0.406: J2.7 12.06,45.09 12.7,45.72 12.7,50.8 13.34,51.44 24.77,51.44 v25.4,52.07
DIN_22  (via drill 0.5 pad 1.02)
  Top 0.406: v24.13,52.7 26.04,54.61 36.83,54.61 R23.1
  Bottom 0.406: J2.8 6.35,46.35 11.43,46.35 12.06,46.99 12.06,51.44 12.7,52.07 23.5,52.07 v24.13,52.7
DIN_23  (via drill 0.5 pad 1.02)
  Top 0.406: v26.67,53.34 33.02,53.34 R24.1
  Bottom 0.406: J2.9 10.79,47.62 11.43,48.26 11.43,52.07 12.06,52.7 22.23,52.7 23.5,53.98 26.04,53.98 v26.67,53.34
DIN_24
  Top 0.406: J2.12 6.35,51.44 10.16,51.44 11.43,52.7 11.43,60.96 12.7,62.23 58.42,62.23 59.69,63.5 R25.1
DIN_25
  Top 0.406: J2.13 9.53,52.7 10.79,53.98 10.79,61.59 12.06,62.87 53.98,62.87 54.61,63.5 R26.1
DIN_26
  Top 0.406: J2.14 6.35,53.98 8.89,53.98 10.16,55.24 10.16,62.23 11.43,63.5 48.26,63.5 49.53,64.77 R27.1
DIN_27
  Bottom 0.406: J2.15 15.24,55.24 20.95,60.96 34.29,60.96 36.2,62.87 42.55,62.87 44.45,64.77 R28.1
DIN_28
  Bottom 0.406: J2.16 6.35,56.52 15.24,56.52 20.32,61.59 32.38,61.59 34.29,63.5 38.1,63.5 39.37,64.77 R29.1
DIN_29
  Bottom 0.406: J2.17 15.24,57.78 19.68,62.23 31.75,62.23 34.29,64.77 R30.1
DIN_30
  Bottom 0.406: J2.18 6.35,59.05 11.43,59.05 12.06,58.42 14.61,58.42 19.05,62.87 27.3,62.87 29.21,64.77 R31.1
DIN_31
  Bottom 0.406: J2.19 11.43,60.33 12.7,59.05 13.97,59.05 18.41,63.5 22.86,63.5 24.13,64.77 R32.1
DIN_32
  Bottom 0.406: J3.2 6.35,91.44 8.89,91.44 9.53,90.81 9.53,80.64 10.16,80.01 53.98,80.01 54.61,80.64 R33.1
DIN_33
  Bottom 0.406: J3.3 9.53,92.71 10.16,92.08 10.16,81.28 10.79,80.64 48.9,80.64 49.53,81.28 R34.1
DIN_34
  Bottom 0.406: J3.4 6.35,93.98 10.16,93.98 10.79,93.34 10.79,81.92 11.43,81.28 43.81,81.28 44.45,81.92 R35.1
DIN_35
  Bottom 0.406: J3.5 10.79,95.25 11.43,94.61 11.43,82.55 12.06,81.92 38.73,81.92 39.37,82.55 R36.1
DIN_36
  Bottom 0.406: J3.6 6.35,96.52 11.43,96.52 12.06,95.89 12.06,83.19 12.7,82.55 33.02,82.55 34.29,83.82 R37.1
DIN_37
  Bottom 0.406: J3.7 12.06,97.79 12.7,97.16 12.7,85.72 13.34,85.09 29.21,85.09 R38.1
DIN_38  (via drill 0.5 pad 1.02)
  Top 0.406: v13.97,87.63 13.97,82.55 14.61,81.92 23.5,81.92 24.13,82.55 R39.1
  Bottom 0.406: J3.8 6.35,99.06 12.7,99.06 13.34,98.42 13.34,88.27 v13.97,87.63
DIN_39  (via drill 0.5 pad 1.02)
  Top 0.406: J3.9 13.34,100.33 14.61,99.06 v14.61,88.9 | v59.69,88.9 74.3,88.9 76.83,86.36 93.98,86.36 95.25,87.63 R40.1
  Bottom 0.406: v14.61,88.9 v59.69,88.9
DIN_40  (via drill 0.5 pad 1.02)
  Top 0.406: v54.61,95.89 R41.1
  Bottom 0.406: J3.12 6.35,104.14 8.89,104.14 10.16,102.87 10.16,100.33 10.79,99.69 13.34,99.69 13.97,99.06 13.97,95.89 14.61,95.25 53.98,95.25 v54.61,95.89
DIN_41
  Bottom 0.406: J3.13 10.16,105.41 10.79,104.78 10.79,101.6 11.43,100.97 13.97,100.97 14.61,100.33 14.61,96.52 15.24,95.89 48.9,95.89 49.53,96.52 R42.1
DIN_42
  Bottom 0.406: J3.14 6.35,106.68 10.79,106.68 11.43,106.05 11.43,102.23 12.06,101.6 14.61,101.6 15.24,100.97 15.24,97.16 15.88,96.52 43.81,96.52 44.45,97.16 R43.1
DIN_43
  Bottom 0.406: J3.15 11.43,107.95 12.06,107.31 12.06,102.87 12.7,102.23 15.24,102.23 15.88,101.6 15.88,97.79 16.51,97.16 38.73,97.16 39.37,97.79 R44.1
DIN_44
  Bottom 0.406: J3.16 6.35,109.22 12.06,109.22 12.7,108.58 12.7,103.5 13.34,102.87 15.88,102.87 16.51,102.23 16.51,98.42 17.14,97.79 33.66,97.79 34.29,98.42 R45.1
DIN_45  (via drill 0.5 pad 1.02)
  Top 0.406: J3.17 14.61,110.49 15.24,109.86 15.24,91.44 v15.88,90.81 | v59.05,91.44 73.03,91.44 76.83,87.63 88.9,87.63 90.17,88.9 R46.1
  Bottom 0.406: v15.88,90.81 15.88,90.17 16.51,89.53 57.15,89.53 v59.05,91.44
DIN_46  (via drill 0.5 pad 1.02)
  Top 0.406: J3.18 6.35,111.76 15.24,111.76 15.88,111.12 15.88,93.34 v17.14,92.08 | v57.78,92.71 59.05,93.98 71.75,93.98 76.83,88.9 83.82,88.9 85.09,90.17 R47.1
  Bottom 0.406: v17.14,92.08 17.14,90.81 17.78,90.17 56.52,90.17 57.78,91.44 v57.78,92.71
DIN_47  (via drill 0.5 pad 1.02)
  Top 0.406: J3.19 15.88,113.03 16.51,112.39 16.51,94.61 v19.05,92.08 | v56.52,93.98 59.05,96.52 79.38,96.52 80.01,95.89 R48.1
  Bottom 0.406: v19.05,92.08 19.68,92.71 55.24,92.71 v56.52,93.98
DIN_48  (via drill 0.5 pad 1.02)
  Top 0.406: v57.15,107.95 58.42,106.68 72.39,106.68 74.3,105.41 88.9,105.41 90.17,106.68 R49.1
  Bottom 0.406: J4.2 20.32,105.41 55.88,105.41 57.15,106.68 v57.15,107.95
DIN_49  (via drill 0.5 pad 1.02)
  Top 0.406: v57.15,109.86 57.78,109.22 73.03,109.22 74.93,107.95 83.82,107.95 R50.1
  Bottom 0.406: J4.3 29.84,106.68 31.11,107.95 55.24,107.95 v57.15,109.86
DIN_50  (via drill 0.5 pad 1.02)
  Top 0.406: v57.15,111.76 77.47,111.76 R51.1
  Bottom 0.406: J4.4 20.32,107.95 29.84,107.95 30.48,108.58 53.98,108.58 v57.15,111.76
DIN_51
  Bottom 0.406: J4.5 52.7,109.22 54.61,111.12 R52.1
DIN_52
  Bottom 0.406: J4.6 20.32,110.49 48.9,110.49 49.53,111.12 R53.1
DIN_53
  Bottom 0.406: J4.7 29.21,111.76 30.48,113.03 43.81,113.03 44.45,113.67 R54.1
DIN_54
  Bottom 0.406: J4.8 20.32,113.03 29.21,113.03 30.48,114.3 38.73,114.3 39.37,114.94 R55.1
DIN_55
  Bottom 0.406: J4.9 29.21,114.3 30.48,115.57 33.02,115.57 34.29,116.84 R56.1
DIN_56  (via drill 0.5 pad 1.02)
  Top 0.406: v29.21,133.35 33.02,133.35 34.29,134.62 R57.1
  Bottom 0.406: J4.12 20.32,118.11 27.94,118.11 28.57,118.75 28.57,132.72 v29.21,133.35
DIN_57
  Bottom 0.406: J4.13 27.3,119.38 27.94,120.02 27.94,135.25 28.57,135.89 39.37,135.89 R58.1
DIN_58
  Bottom 0.406: J4.14 20.32,120.65 26.67,120.65 27.3,121.28 27.3,137.79 27.94,138.43 43.18,138.43 R59.1
DIN_59
  Bottom 0.406: J4.15 26.04,121.92 26.67,122.56 26.67,138.43 27.3,139.06 47.62,139.06 R60.1
DIN_60
  Bottom 0.406: J4.16 20.32,123.19 25.4,123.19 26.04,123.83 26.04,139.06 26.67,139.7 53.98,139.7 54.61,139.06 R61.1
DIN_61
  Bottom 0.406: J4.17 24.77,124.46 25.4,125.09 25.4,139.7 26.04,140.34 59.05,140.34 59.69,139.7 R62.1
DIN_62
  Bottom 0.406: J4.18 20.32,125.73 24.13,125.73 24.77,126.36 24.77,140.34 25.4,140.97 64.14,140.97 64.77,140.34 R63.1
DIN_63
  Bottom 0.406: J4.19 22.86,127 24.13,128.27 24.13,144.15 24.77,144.78 73.03,144.78 73.66,144.15 73.66,141.6 74.93,140.34 R64.1
GND
  Top 0.61: D24.A 31.75,17.78 | 31.75,17.78 36.83,17.78 | 36.83,17.78 41.91,17.78 | 41.91,17.78 46.99,17.78 | 46.99,17.78 52.07,17.78 | 52.07,17.78 57.15,17.78 | 57.15,17.78 65.41,17.78 | 65.41,17.78 72.39,17.78 | 72.39,17.78 77.47,17.78 D3.A | D6.A 72.39,17.78 | D9.A 57.15,17.78 | D12.A 52.07,17.78 | D15.A 46.99,17.78 | D18.A 41.91,17.78 | D21.A 36.83,17.78 | 36.83,107.95 31.75,107.95 D135.A 25.4,106.68 22.86,104.14 J4.1 21.59,92.71 | 36.83,107.95 41.91,107.95 | 41.91,107.95 46.99,107.95 | 46.99,107.95 52.07,107.95 D123.A | D126.A 46.99,107.95 | D129.A 41.91,107.95 | D132.A 36.83,107.95 | D117.A 21.59,92.71 | 21.59,92.71 26.67,92.71 | 26.67,92.71 31.75,92.71 | 31.75,92.71 36.83,92.71 | 36.83,92.71 41.91,92.71 | 41.91,92.71 46.99,92.71 | 46.99,92.71 52.07,92.71 D99.A | D102.A 46.99,92.71 | D105.A 41.91,92.71 | D108.A 36.83,92.71 | D111.A 31.75,92.71 | D114.A 26.67,92.71 | D168.A 31.75,125.73 36.83,125.73 | 36.83,125.73 41.91,125.73 | 41.91,125.73 46.99,125.73 | 46.99,125.73 52.07,125.73 D156.A | D159.A 46.99,125.73 | D162.A 41.91,125.73 | D165.A 36.83,125.73 | 26.67,73.66 21.59,73.66 D96.A C2.1 R65.1 | 26.67,73.66 31.75,73.66 | 31.75,73.66 36.83,73.66 | 36.83,73.66 41.91,73.66 | 41.91,73.66 46.99,73.66 | 46.99,73.66 52.07,73.66 | 52.07,73.66 57.15,73.66 | 57.15,73.66 D75.A | D78.A 52.07,73.66 | D81.A 46.99,73.66 | D84.A 41.91,73.66 | D87.A 36.83,73.66 | D90.A 31.75,73.66 | D93.A 26.67,73.66 | D57.A 57.15,58.42 | 57.15,58.42 52.07,58.42 | 52.07,58.42 46.99,58.42 | 46.99,58.42 41.91,58.42 | 41.91,58.42 36.83,58.42 | 36.83,58.42 31.75,58.42 D72.A | D69.A 36.83,58.42 | D66.A 41.91,58.42 | D63.A 46.99,58.42 | D60.A 52.07,58.42 | C1.2 65.41,17.78 | PP6.1 PP5.1 | PP5.1 PP4.1 | PP5.1 D171.A | 31.75,17.78 27.94,17.78 J1.1
  Top 0.61: J1.11 24.13,36.2 25.4,37.47 25.4,40.64 26.04,41.27 31.11,41.27 D27.A | D192.A 72.39,143.51 77.47,143.51 D153.A | 57.15,58.42 58.42,58.42 61.59,61.59 61.59,73.03 60.96,73.66 57.15,73.66
  Bottom 0.61: J3.11 J3.10 3.17,100.33 | J1.11 J1.10 17.78,33.66 | J2.11 J2.10 3.17,47.62 | D27.A 31.75,41.91 36.83,41.91 | 36.83,41.91 41.91,41.91 | 41.91,41.91 46.99,41.91 | 46.99,41.91 52.07,41.91 D39.A | D36.A 46.99,41.91 | D33.A 41.91,41.91 | D30.A 36.83,41.91 | D153.A 77.47,115.57 82.55,115.57 | 82.55,115.57 87.63,115.57 | 87.63,115.57 D147.A | D150.A 82.55,115.57 | D144.A 77.47,99.06 82.55,99.06 | 82.55,99.06 87.63,99.06 | 87.63,99.06 92.71,99.06 | 92.71,99.06 D120.A | D138.A 87.63,99.06 | D141.A 82.55,99.06 | D42.A 88.9,57.78 | 88.9,57.78 83.82,57.78 | 83.82,57.78 78.74,57.78 D48.A | D45.A 83.82,57.78 | D51.A 77.47,74.93 | 77.47,74.93 82.55,74.93 | 82.55,74.93 D54.A | D171.A 31.75,143.51 36.83,143.51 | 36.83,143.51 41.91,143.51 | 41.91,143.51 46.99,143.51 | 46.99,143.51 52.07,143.51 | 52.07,143.51 57.15,143.51 | 57.15,143.51 62.23,143.51 | 62.23,143.51 72.39,143.51 D192.A | D189.A 62.23,143.51 | D186.A 57.15,143.51 | D183.A 52.07,143.51 | D180.A 46.99,143.51 | D177.A 41.91,143.51 | D174.A 36.83,143.51 | J2.20 3.17,60.33 | 3.17,60.33 3.17,47.62 | 3.17,47.62 3.17,35.56 7.62,35.56 | 7.62,35.56 J2.1 | J1.20 17.78,46.35 17.78,35.56 | 17.78,35.56 17.78,33.66 | 17.78,33.66 17.78,21.59 20.32,21.59 J1.1 | 3.17,100.33 3.17,113.03 J3.20 7.62,115.57 17.14,115.57 | 3.17,100.33 3.17,88.27 4.45,88.27 | 4.45,88.27 5.71,88.27 J3.1 | J4.20 17.14,127 | 17.14,127 17.14,115.57 | 17.14,115.57 17.14,114.3 | 17.14,114.3 17.14,102.87 17.78,102.23 19.68,102.23 J4.1 | 17.14,114.3 J4.10 J4.11 28.57,116.84 29.84,118.11 29.84,122.56 D168.A | C4.1 PP4.1 | 77.47,74.93 C3.1 | 17.14,127 17.14,132.08 22.23,137.16 22.23,145.41 24.13,147.32 PP6.1 | 4.45,88.27 4.45,72.39 | 4.45,72.39 R65.1 | 4.45,72.39 3.17,71.12 3.17,60.33
  Bottom 0.61: 7.62,35.56 17.78,35.56 | 87.63,115.57 92.71,115.57 92.71,99.06 | 92.71,99.06 97.16,99.06 97.16,74.93 88.9,74.93 | 88.9,74.93 82.55,74.93 | 88.9,57.78 88.9,74.93

### Text on the board
tPlace: 0V | 5V | P2P_PROT_1 | James Newman | GND | 3 | 2 | 1 | 0